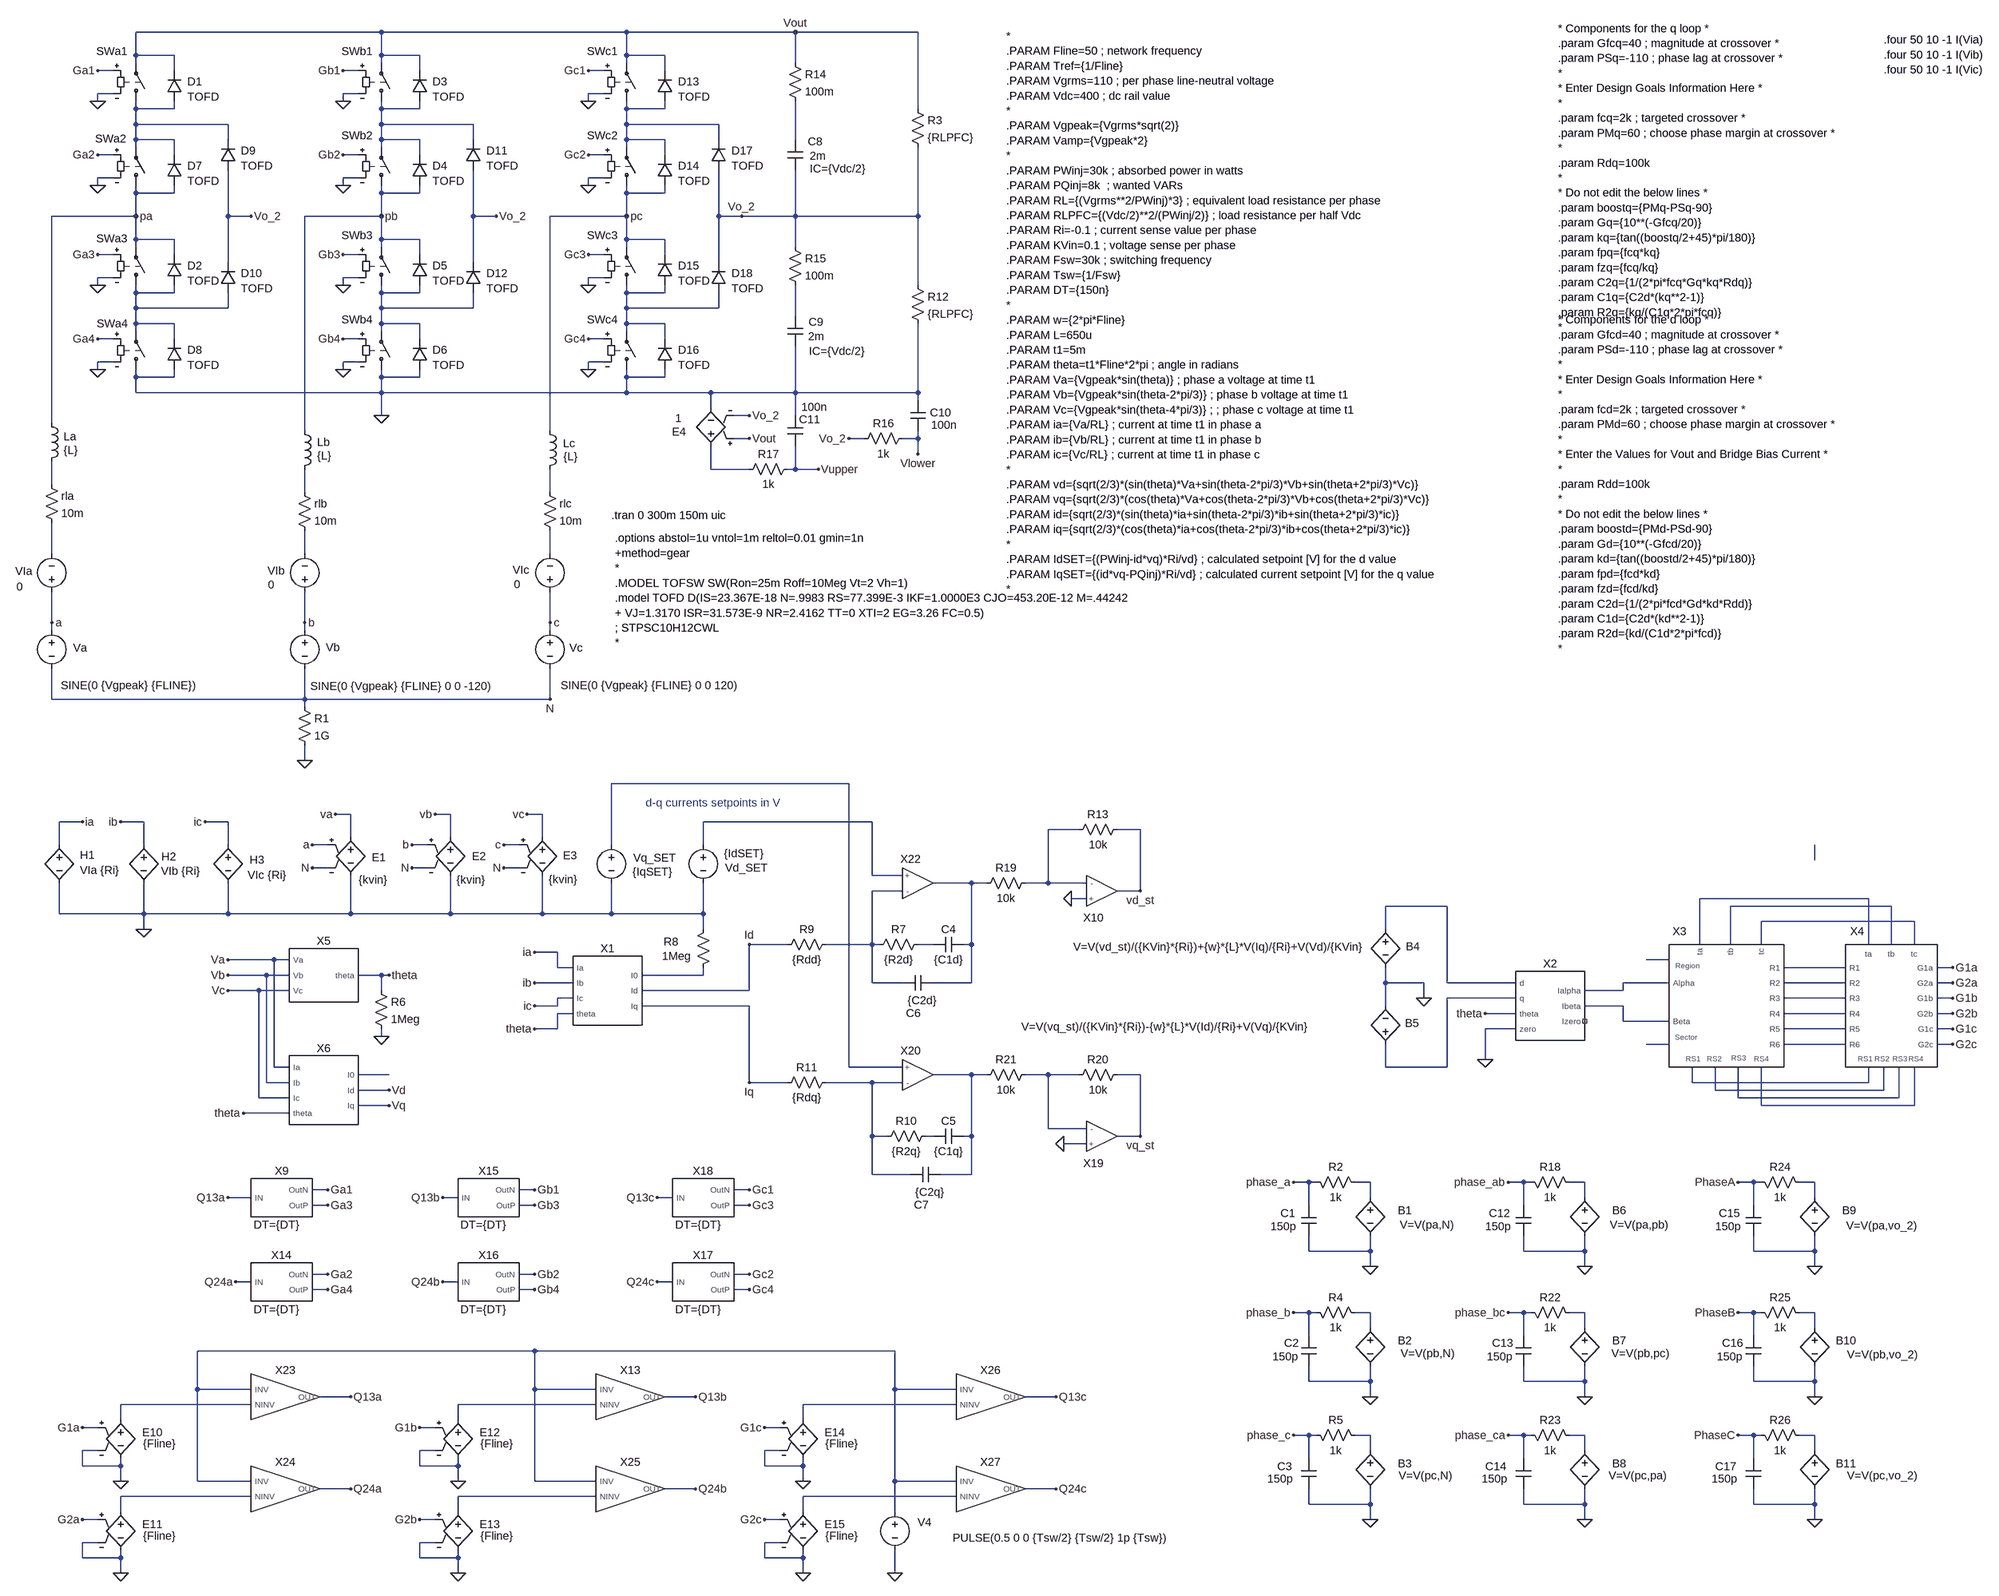
[diagram p0: schematic 3-phase NPC inverter with switches - PFC open loop - SVM.asc]
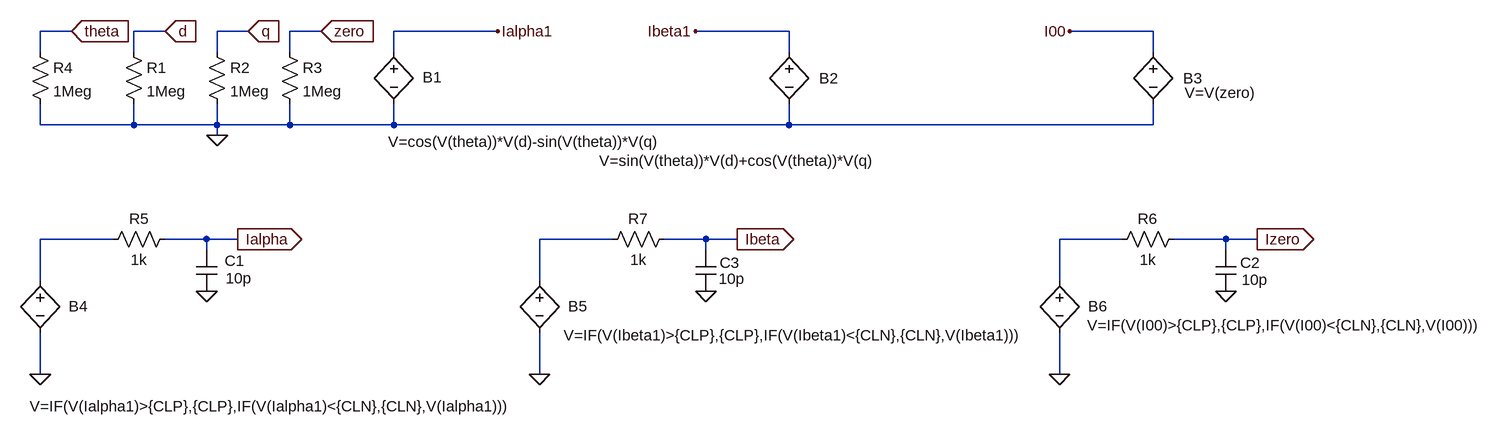
[diagram p1: sub-circuit inverse_dq_alpha_beta.asc]
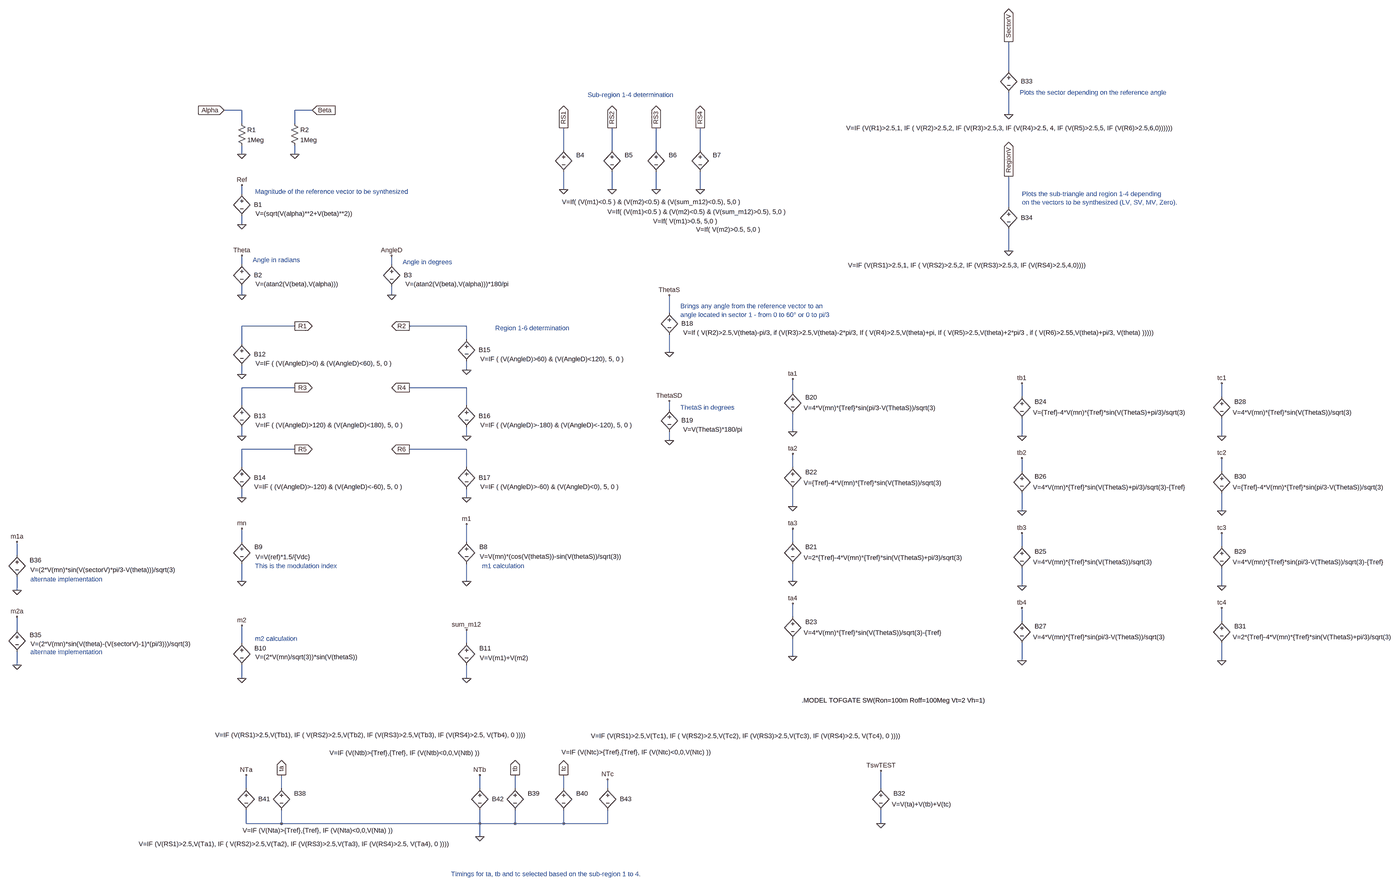
[diagram p2: sub-circuit alphabetatimings.asc, whole sheet]
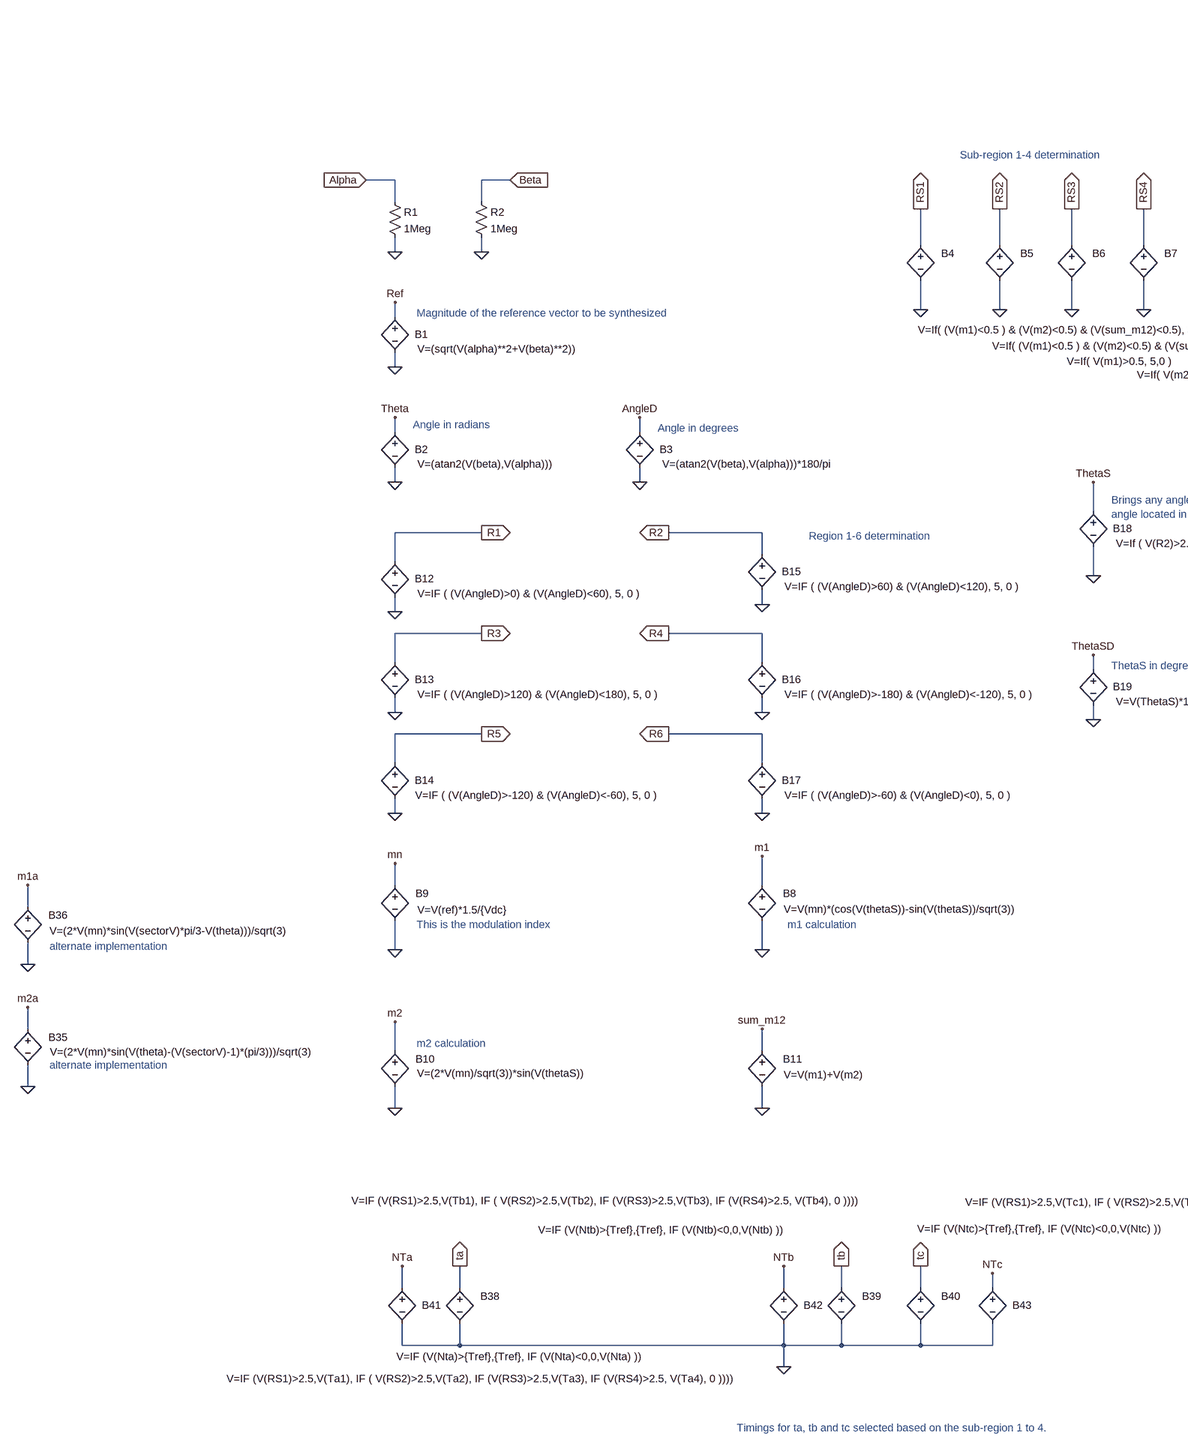
[diagram p3: sub-circuit alphabetatimings.asc, part, row 1 of 1, column 1 of 2]
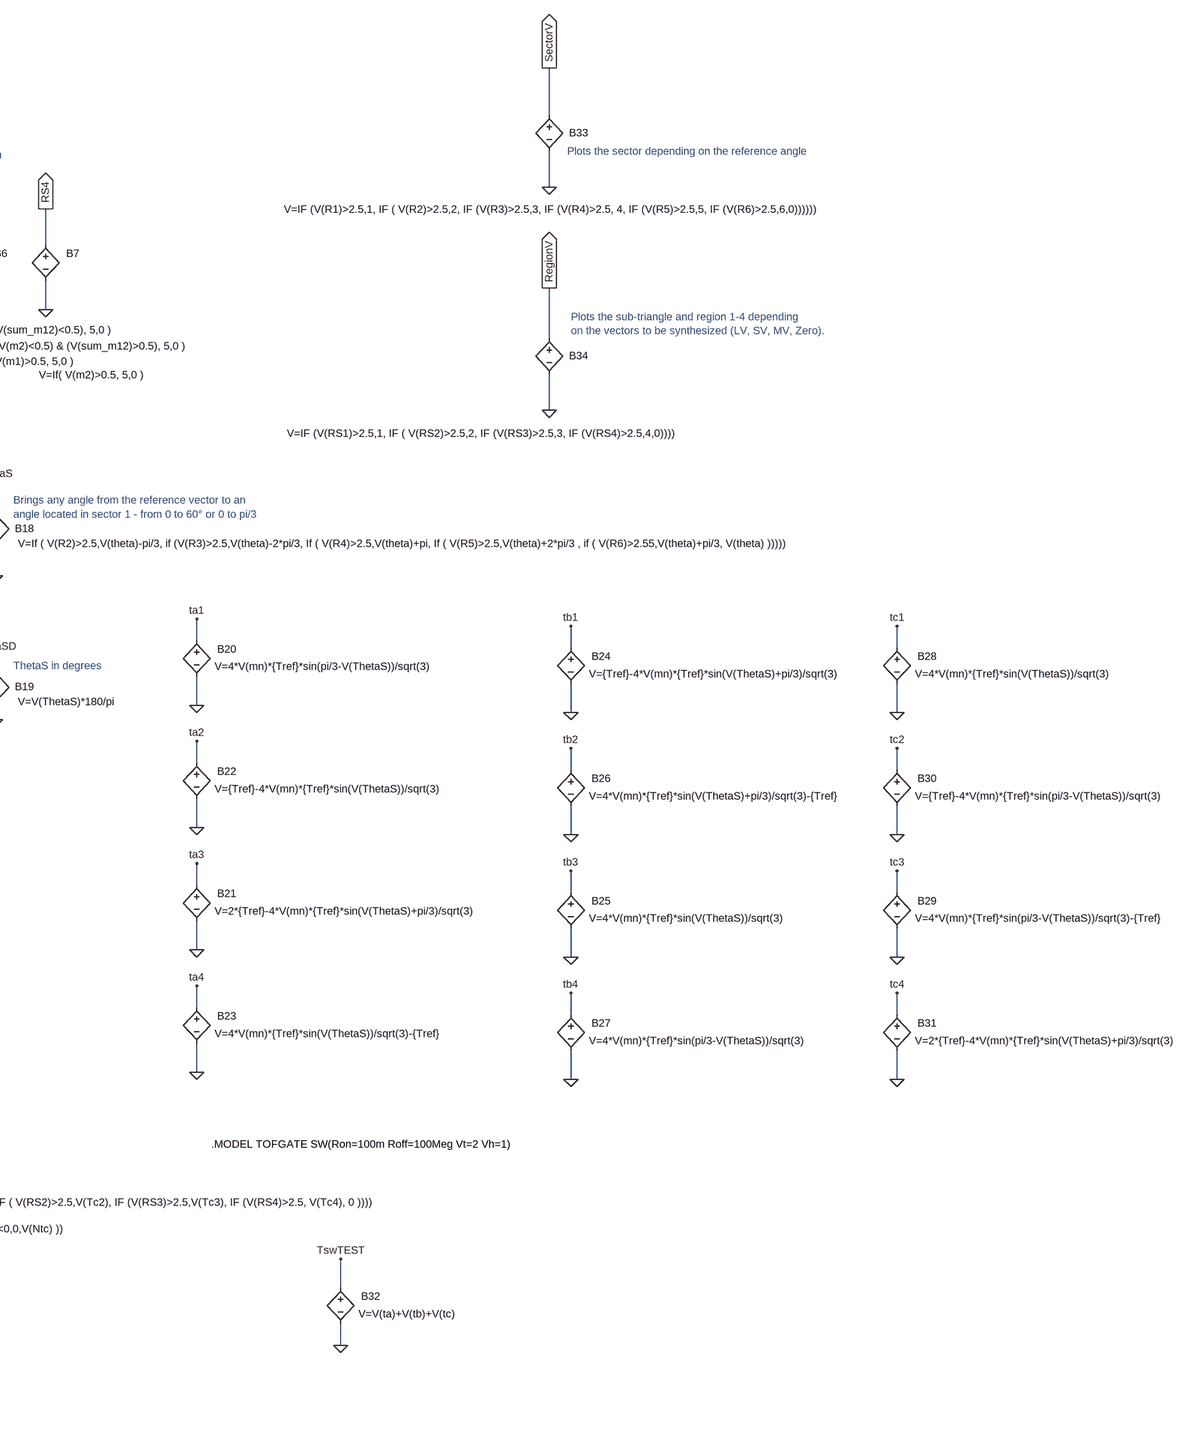
[diagram p4: sub-circuit alphabetatimings.asc, part, row 1 of 1, column 2 of 2]
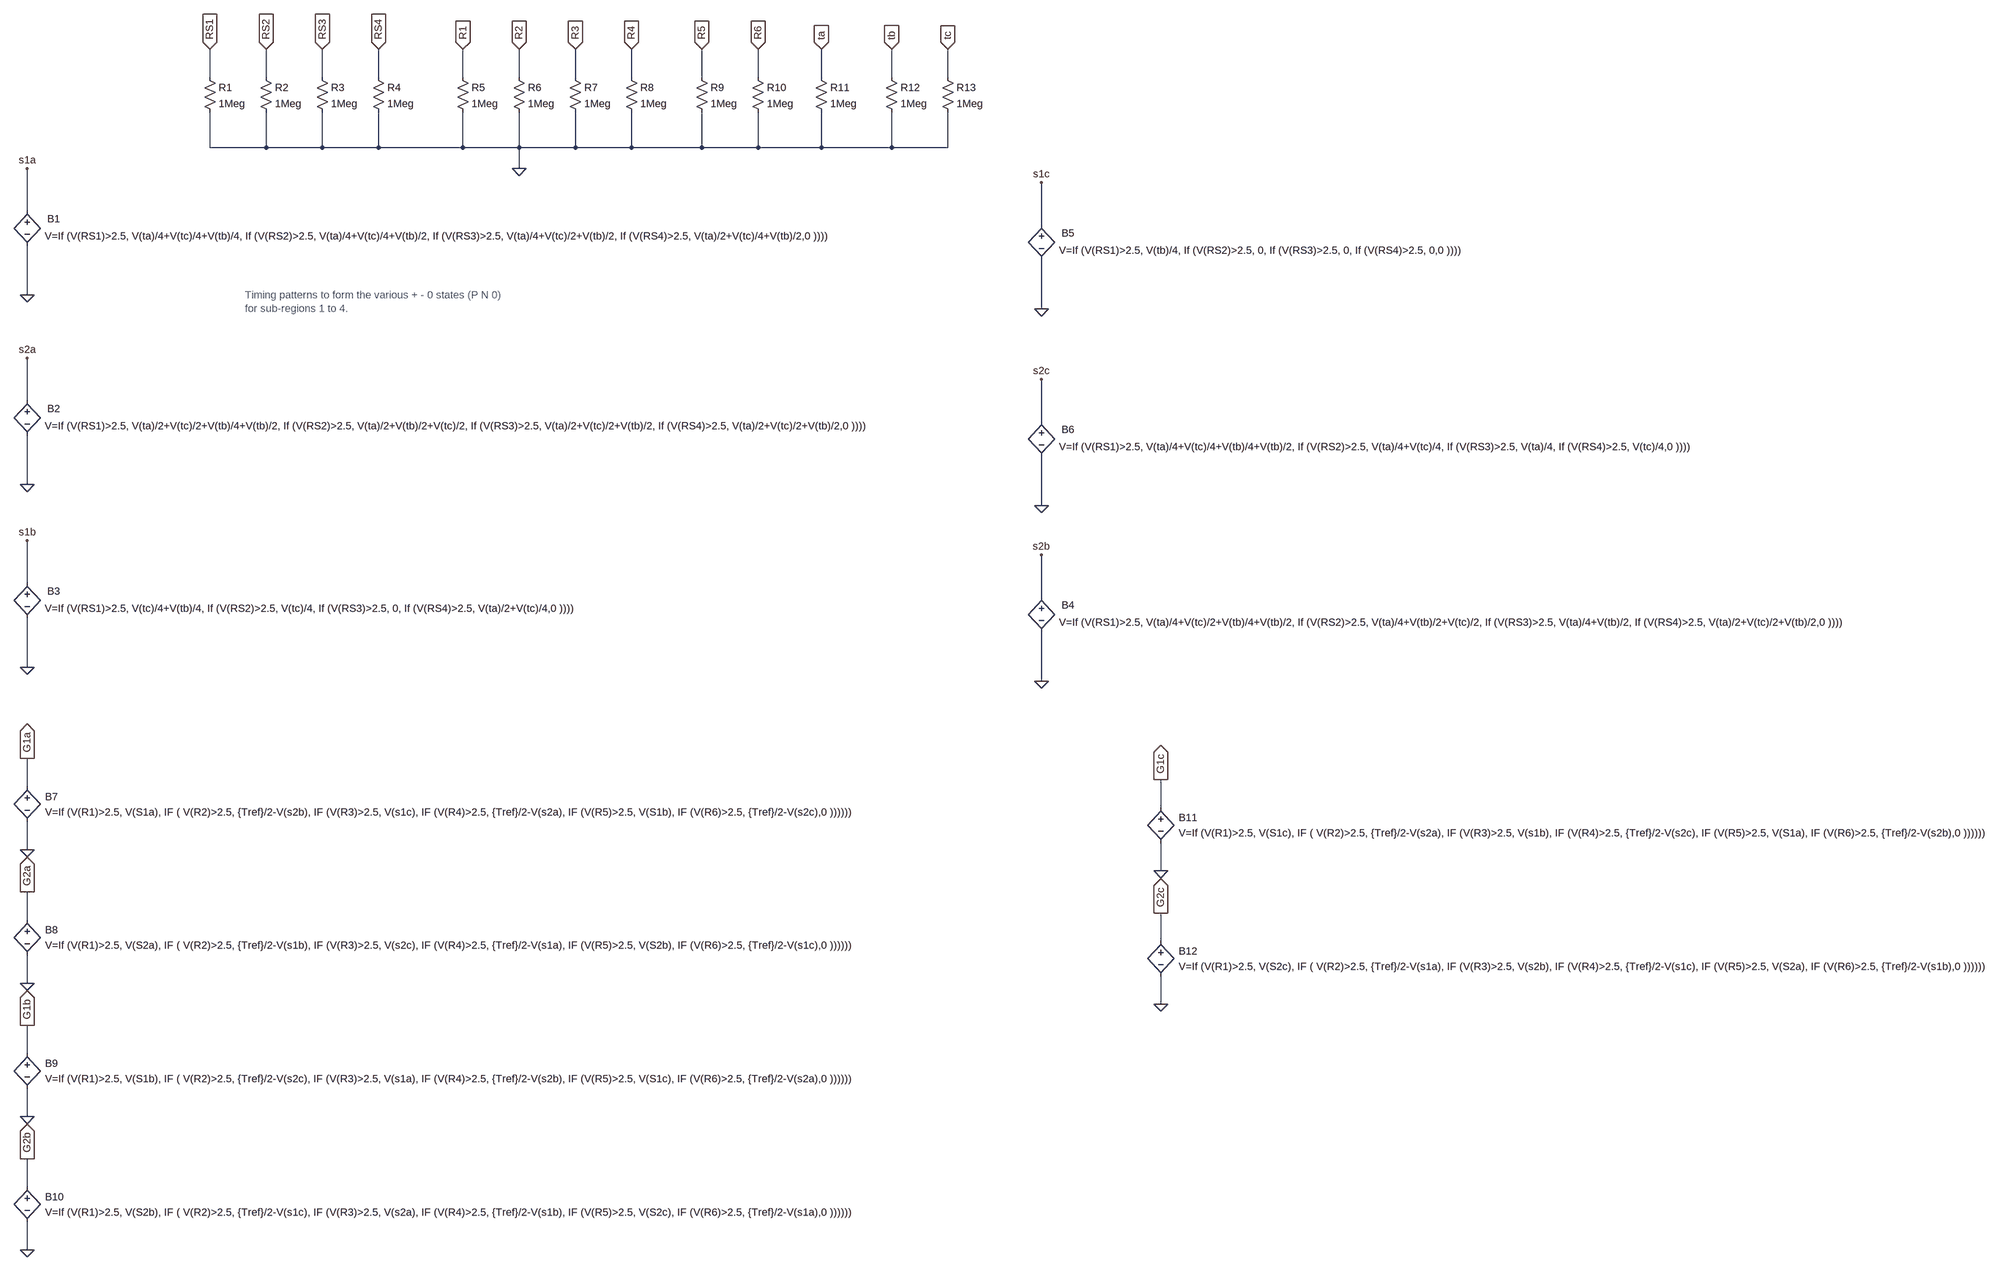
[diagram p5: sub-circuit timinggenerator.asc]
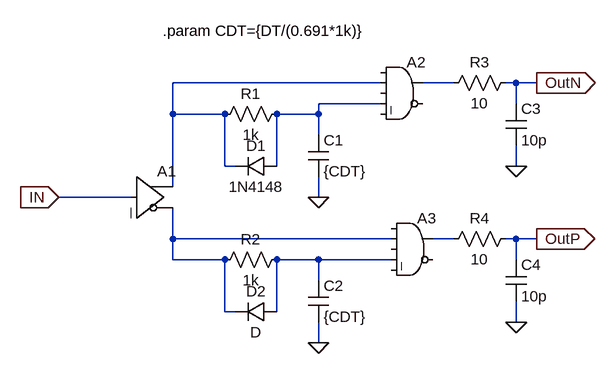
[diagram p6: sub-circuit dt_driver.asc]
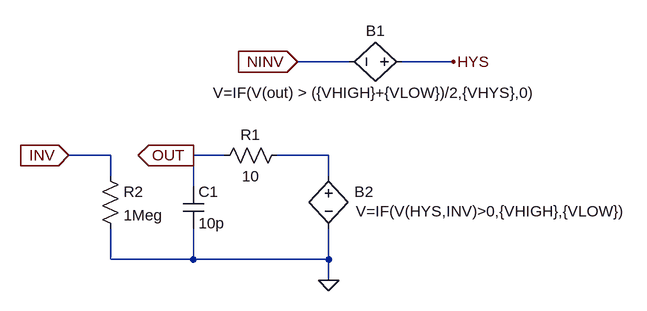
[diagram p7: sub-circuit comptof.asc]
3-phase NPC inverter with switches - PFC open loop - SVM.asc, the LTspice schematic file:
Version 4.1
SHEET 1 4820 2676
WIRE 496 -1056 -16 -1056
WIRE 1008 -1056 496 -1056
WIRE 1360 -1056 1008 -1056
WIRE 1616 -1056 1360 -1056
WIRE -16 -1008 -16 -1056
WIRE 64 -1008 -16 -1008
WIRE 496 -1008 496 -1056
WIRE 576 -1008 496 -1008
WIRE 1008 -1008 1008 -1056
WIRE 1088 -1008 1008 -1008
WIRE -16 -992 -16 -1008
WIRE 496 -992 496 -1008
WIRE 1008 -992 1008 -1008
WIRE 1360 -992 1360 -1056
WIRE -64 -976 -96 -976
WIRE 64 -976 64 -1008
WIRE 448 -976 416 -976
WIRE 576 -976 576 -1008
WIRE 960 -976 928 -976
WIRE 1088 -976 1088 -1008
WIRE -64 -928 -96 -928
WIRE 448 -928 416 -928
WIRE 960 -928 928 -928
WIRE -96 -912 -96 -928
WIRE 416 -912 416 -928
WIRE 928 -912 928 -928
WIRE -16 -896 -16 -912
WIRE 64 -896 64 -912
WIRE 64 -896 -16 -896
WIRE 496 -896 496 -912
WIRE 576 -896 576 -912
WIRE 576 -896 496 -896
WIRE 1008 -896 1008 -912
WIRE 1088 -896 1088 -912
WIRE 1088 -896 1008 -896
WIRE 1616 -896 1616 -1056
WIRE -16 -864 -16 -896
WIRE 176 -864 -16 -864
WIRE 496 -864 496 -896
WIRE 688 -864 496 -864
WIRE 1008 -864 1008 -896
WIRE 1200 -864 1008 -864
WIRE -16 -832 -16 -864
WIRE 64 -832 -16 -832
WIRE 176 -832 176 -864
WIRE 496 -832 496 -864
WIRE 576 -832 496 -832
WIRE 688 -832 688 -864
WIRE 1008 -832 1008 -864
WIRE 1088 -832 1008 -832
WIRE 1200 -832 1200 -864
WIRE 1360 -832 1360 -912
WIRE -16 -816 -16 -832
WIRE 496 -816 496 -832
WIRE 1008 -816 1008 -832
WIRE -64 -800 -96 -800
WIRE 64 -800 64 -832
WIRE 448 -800 416 -800
WIRE 576 -800 576 -832
WIRE 960 -800 928 -800
WIRE 1088 -800 1088 -832
WIRE -64 -752 -96 -752
WIRE 448 -752 416 -752
WIRE 960 -752 928 -752
WIRE -96 -736 -96 -752
WIRE 416 -736 416 -752
WIRE 928 -736 928 -752
WIRE -16 -720 -16 -736
WIRE 64 -720 64 -736
WIRE 64 -720 -16 -720
WIRE 496 -720 496 -736
WIRE 576 -720 576 -736
WIRE 576 -720 496 -720
WIRE 1008 -720 1008 -736
WIRE 1088 -720 1088 -736
WIRE 1088 -720 1008 -720
WIRE -16 -672 -16 -720
WIRE -16 -672 -192 -672
WIRE 176 -672 176 -768
WIRE 224 -672 176 -672
WIRE 496 -672 496 -720
WIRE 496 -672 336 -672
WIRE 688 -672 688 -768
WIRE 736 -672 688 -672
WIRE 1008 -672 1008 -720
WIRE 1008 -672 848 -672
WIRE 1200 -672 1200 -768
WIRE 1248 -672 1200 -672
WIRE 1360 -672 1360 -768
WIRE 1360 -672 1248 -672
WIRE 1616 -672 1616 -816
WIRE 1616 -672 1360 -672
WIRE -16 -624 -16 -672
WIRE 64 -624 -16 -624
WIRE 496 -624 496 -672
WIRE 576 -624 496 -624
WIRE 1008 -624 1008 -672
WIRE 1088 -624 1008 -624
WIRE -16 -608 -16 -624
WIRE 496 -608 496 -624
WIRE 1008 -608 1008 -624
WIRE 1360 -608 1360 -672
WIRE -64 -592 -96 -592
WIRE 64 -592 64 -624
WIRE 448 -592 416 -592
WIRE 576 -592 576 -624
WIRE 960 -592 928 -592
WIRE 1088 -592 1088 -624
WIRE 176 -576 176 -672
WIRE 688 -576 688 -672
WIRE 1200 -576 1200 -672
WIRE -64 -544 -96 -544
WIRE 448 -544 416 -544
WIRE 960 -544 928 -544
WIRE -96 -528 -96 -544
WIRE 416 -528 416 -544
WIRE 928 -528 928 -544
WIRE 1616 -528 1616 -672
WIRE -16 -512 -16 -528
WIRE 64 -512 64 -528
WIRE 64 -512 -16 -512
WIRE 496 -512 496 -528
WIRE 576 -512 576 -528
WIRE 576 -512 496 -512
WIRE 1008 -512 1008 -528
WIRE 1088 -512 1088 -528
WIRE 1088 -512 1008 -512
WIRE -16 -480 -16 -512
WIRE 176 -480 176 -512
WIRE 176 -480 -16 -480
WIRE 496 -480 496 -512
WIRE 688 -480 688 -512
WIRE 688 -480 496 -480
WIRE 1008 -480 1008 -512
WIRE 1200 -480 1200 -512
WIRE 1200 -480 1008 -480
WIRE 1360 -464 1360 -528
WIRE -16 -448 -16 -480
WIRE 64 -448 -16 -448
WIRE 496 -448 496 -480
WIRE 576 -448 496 -448
WIRE 1008 -448 1008 -480
WIRE 1088 -448 1008 -448
WIRE -16 -432 -16 -448
WIRE 496 -432 496 -448
WIRE 1008 -432 1008 -448
WIRE -64 -416 -96 -416
WIRE 64 -416 64 -448
WIRE 448 -416 416 -416
WIRE 576 -416 576 -448
WIRE 960 -416 928 -416
WIRE 1088 -416 1088 -448
WIRE -64 -368 -96 -368
WIRE 448 -368 416 -368
WIRE 960 -368 928 -368
WIRE -96 -352 -96 -368
WIRE 416 -352 416 -368
WIRE 928 -352 928 -368
WIRE -16 -336 -16 -352
WIRE 64 -336 64 -352
WIRE 64 -336 -16 -336
WIRE 496 -336 496 -352
WIRE 576 -336 576 -352
WIRE 576 -336 496 -336
WIRE 1008 -336 1008 -352
WIRE 1088 -336 1088 -352
WIRE 1088 -336 1008 -336
WIRE -16 -304 -16 -336
WIRE 496 -304 496 -336
WIRE 496 -304 -16 -304
WIRE 1008 -304 1008 -336
WIRE 1008 -304 496 -304
WIRE 1184 -304 1008 -304
WIRE 1360 -304 1360 -400
WIRE 1360 -304 1184 -304
WIRE 1616 -304 1616 -448
WIRE 1616 -304 1360 -304
WIRE 1616 -288 1616 -304
WIRE 1184 -272 1184 -304
WIRE 496 -256 496 -304
WIRE 1264 -256 1232 -256
WIRE 1360 -256 1360 -304
WIRE -192 -240 -192 -672
WIRE 336 -224 336 -672
WIRE 848 -224 848 -672
WIRE 1264 -208 1232 -208
WIRE 1504 -208 1472 -208
WIRE 1616 -208 1616 -224
WIRE 1616 -208 1584 -208
WIRE 1616 -176 1616 -208
WIRE 1184 -144 1184 -192
WIRE 1264 -144 1184 -144
WIRE 1360 -144 1360 -192
WIRE 1360 -144 1344 -144
WIRE 1408 -144 1360 -144
WIRE -192 -112 -192 -160
WIRE 336 -96 336 -144
WIRE 848 -96 848 -144
WIRE -192 32 -192 -32
WIRE 336 32 336 -16
WIRE 848 32 848 -16
WIRE -192 176 -192 112
WIRE 336 176 336 112
WIRE 848 176 848 112
WIRE -192 192 -192 176
WIRE 336 192 336 176
WIRE 848 192 848 176
WIRE -192 336 -192 272
WIRE 336 336 336 272
WIRE 336 336 -192 336
WIRE 848 336 848 272
WIRE 848 336 336 336
WIRE 336 352 336 336
WIRE 336 464 336 432
WIRE 1472 512 976 512
WIRE 432 576 400 576
WIRE 640 576 608 576
WIRE 832 576 800 576
WIRE -128 592 -176 592
WIRE 0 592 -48 592
WIRE 176 592 128 592
WIRE 1520 592 1168 592
WIRE 1952 608 1888 608
WIRE 2080 608 2032 608
WIRE 432 624 432 576
WIRE 640 624 640 576
WIRE 832 624 832 576
WIRE -176 640 -176 592
WIRE 0 640 0 592
WIRE 176 640 176 592
WIRE 384 640 352 640
WIRE 592 640 560 640
WIRE 784 640 752 640
WIRE 976 640 976 512
WIRE 1168 640 1168 592
WIRE 3488 672 3488 640
WIRE 384 688 352 688
WIRE 592 688 560 688
WIRE 784 688 752 688
WIRE 1520 704 1520 592
WIRE 1584 704 1520 704
WIRE 1728 720 1648 720
WIRE 1760 720 1728 720
WIRE 1888 720 1888 608
WIRE 1888 720 1840 720
WIRE 1968 720 1888 720
WIRE 1584 736 1520 736
WIRE 2080 736 2080 608
WIRE 2080 736 2032 736
WIRE 1968 752 1936 752
WIRE 3600 752 3248 752
WIRE 2720 768 2592 768
WIRE 3648 768 3312 768
WIRE -176 784 -176 720
WIRE 0 784 0 720
WIRE 0 784 -176 784
WIRE 176 784 176 720
WIRE 176 784 0 784
WIRE 432 784 432 704
WIRE 432 784 176 784
WIRE 640 784 640 704
WIRE 640 784 432 784
WIRE 832 784 832 704
WIRE 832 784 640 784
WIRE 976 784 976 720
WIRE 976 784 832 784
WIRE 1168 784 1168 720
WIRE 1168 784 976 784
WIRE 3696 800 3376 800
WIRE 0 816 0 784
WIRE 1168 816 1168 784
WIRE 2592 816 2592 768
WIRE 1344 848 1264 848
WIRE 1520 848 1520 736
WIRE 1520 848 1424 848
WIRE 1536 848 1520 848
WIRE 1648 848 1616 848
WIRE 1728 848 1728 720
WIRE 1728 848 1712 848
WIRE 3248 848 3248 752
WIRE 3312 848 3312 768
WIRE 3376 848 3376 800
WIRE 3600 848 3600 752
WIRE 3648 848 3648 768
WIRE 3696 848 3696 800
WIRE 864 864 816 864
WIRE 272 880 176 880
WIRE 304 880 272 880
WIRE 3184 880 3136 880
WIRE 864 896 864 864
WIRE 896 896 864 896
WIRE 3552 896 3424 896
WIRE 3776 896 3744 896
WIRE 256 912 176 912
WIRE 304 912 256 912
WIRE 496 912 448 912
WIRE 512 912 496 912
WIRE 1168 912 1168 896
WIRE 1168 912 1040 912
WIRE 896 928 816 928
WIRE 1520 928 1520 848
WIRE 1584 928 1520 928
WIRE 1728 928 1728 848
WIRE 1728 928 1648 928
WIRE 2592 928 2592 896
WIRE 2672 928 2592 928
WIRE 2720 928 2720 768
WIRE 2864 928 2720 928
WIRE 3184 928 3088 928
WIRE 3552 928 3424 928
WIRE 3776 928 3744 928
WIRE 240 944 176 944
WIRE 304 944 240 944
WIRE 496 944 496 912
WIRE 1264 944 1264 848
WIRE 1264 944 1040 944
WIRE 3088 944 3088 928
WIRE 3088 944 3008 944
WIRE 896 960 864 960
WIRE 2672 960 2672 928
WIRE 2864 960 2720 960
WIRE 3552 960 3424 960
WIRE 3776 960 3744 960
WIRE 864 976 864 960
WIRE 864 976 816 976
WIRE 1264 976 1040 976
WIRE 2592 976 2592 928
WIRE 3088 976 3008 976
WIRE 896 992 864 992
WIRE 2864 992 2800 992
WIRE 3552 992 3424 992
WIRE 3776 992 3744 992
WIRE 3088 1008 3088 976
WIRE 3184 1008 3088 1008
WIRE 864 1024 864 992
WIRE 864 1024 816 1024
WIRE 2864 1024 2800 1024
WIRE 3552 1024 3424 1024
WIRE 3776 1024 3744 1024
WIRE 496 1040 496 1024
WIRE 3184 1056 3136 1056
WIRE 3552 1056 3424 1056
WIRE 3776 1056 3744 1056
WIRE 2800 1088 2800 1024
WIRE 272 1104 272 880
WIRE 304 1104 272 1104
WIRE 1472 1104 1472 512
WIRE 1584 1104 1472 1104
WIRE 2592 1104 2592 1056
WIRE 2720 1104 2720 960
WIRE 2720 1104 2592 1104
WIRE 512 1120 448 1120
WIRE 1728 1120 1648 1120
WIRE 1760 1120 1728 1120
WIRE 1888 1120 1840 1120
WIRE 1952 1120 1888 1120
WIRE 2080 1120 2032 1120
WIRE 256 1136 256 912
WIRE 304 1136 256 1136
WIRE 1264 1136 1264 976
WIRE 1344 1136 1264 1136
WIRE 1520 1136 1424 1136
WIRE 1584 1136 1520 1136
WIRE 3232 1136 3232 1104
WIRE 3600 1136 3600 1104
WIRE 3600 1136 3232 1136
WIRE 512 1152 448 1152
WIRE 3280 1152 3280 1104
WIRE 3632 1152 3632 1104
WIRE 3632 1152 3280 1152
WIRE 240 1168 240 944
WIRE 304 1168 240 1168
WIRE 3328 1168 3328 1104
WIRE 3664 1168 3664 1104
WIRE 3664 1168 3328 1168
WIRE 512 1184 448 1184
WIRE 3376 1184 3376 1104
WIRE 3696 1184 3696 1104
WIRE 3696 1184 3376 1184
WIRE 304 1200 208 1200
WIRE 1888 1232 1888 1120
WIRE 1968 1232 1888 1232
WIRE 1520 1248 1520 1136
WIRE 1552 1248 1520 1248
WIRE 1648 1248 1632 1248
WIRE 1728 1248 1728 1120
WIRE 1728 1248 1712 1248
WIRE 2080 1248 2080 1120
WIRE 2080 1248 2032 1248
WIRE 1968 1264 1920 1264
WIRE 1520 1328 1520 1248
WIRE 1600 1328 1520 1328
WIRE 1728 1328 1728 1248
WIRE 1728 1328 1664 1328
WIRE 2432 1344 2400 1344
WIRE 2448 1344 2432 1344
WIRE 2560 1344 2528 1344
WIRE 2880 1344 2848 1344
WIRE 2896 1344 2880 1344
WIRE 3008 1344 2976 1344
WIRE 3360 1344 3328 1344
WIRE 3376 1344 3360 1344
WIRE 3488 1344 3456 1344
WIRE 384 1360 352 1360
WIRE 816 1360 784 1360
WIRE 1264 1360 1232 1360
WIRE 224 1376 176 1376
WIRE 656 1376 624 1376
WIRE 1104 1376 1072 1376
WIRE 2560 1376 2560 1344
WIRE 3008 1376 3008 1344
WIRE 3488 1376 3488 1344
WIRE 384 1392 352 1392
WIRE 816 1392 784 1392
WIRE 1264 1392 1232 1392
WIRE 2432 1392 2432 1344
WIRE 2880 1392 2880 1344
WIRE 3360 1392 3360 1344
WIRE 2432 1488 2432 1456
WIRE 2560 1488 2560 1456
WIRE 2560 1488 2432 1488
WIRE 2880 1488 2880 1456
WIRE 3008 1488 3008 1456
WIRE 3008 1488 2880 1488
WIRE 3360 1488 3360 1456
WIRE 3488 1488 3488 1456
WIRE 3488 1488 3360 1488
WIRE 2560 1520 2560 1488
WIRE 3008 1520 3008 1488
WIRE 3488 1520 3488 1488
WIRE 384 1536 352 1536
WIRE 816 1536 784 1536
WIRE 1264 1536 1232 1536
WIRE 224 1552 192 1552
WIRE 656 1552 624 1552
WIRE 1104 1552 1072 1552
WIRE 384 1568 352 1568
WIRE 816 1568 784 1568
WIRE 1264 1568 1232 1568
WIRE 2432 1616 2400 1616
WIRE 2448 1616 2432 1616
WIRE 2560 1616 2528 1616
WIRE 2880 1616 2848 1616
WIRE 2896 1616 2880 1616
WIRE 3008 1616 2976 1616
WIRE 3360 1616 3328 1616
WIRE 3376 1616 3360 1616
WIRE 3488 1616 3456 1616
WIRE 2560 1648 2560 1616
WIRE 3008 1648 3008 1616
WIRE 3488 1648 3488 1616
WIRE 2432 1664 2432 1616
WIRE 2880 1664 2880 1616
WIRE 3360 1664 3360 1616
WIRE 816 1696 112 1696
WIRE 1568 1696 816 1696
WIRE 2432 1760 2432 1728
WIRE 2560 1760 2560 1728
WIRE 2560 1760 2432 1760
WIRE 2880 1760 2880 1728
WIRE 3008 1760 3008 1728
WIRE 3008 1760 2880 1760
WIRE 3360 1760 3360 1728
WIRE 3488 1760 3488 1728
WIRE 3488 1760 3360 1760
WIRE 112 1776 112 1696
WIRE 224 1776 112 1776
WIRE 816 1776 816 1696
WIRE 944 1776 816 1776
WIRE 1568 1776 1568 1696
WIRE 1696 1776 1568 1776
WIRE 432 1792 368 1792
WIRE 1152 1792 1088 1792
WIRE 1904 1792 1840 1792
WIRE 2560 1792 2560 1760
WIRE 3008 1792 3008 1760
WIRE 3488 1792 3488 1760
WIRE 224 1808 -48 1808
WIRE 944 1808 656 1808
WIRE 1696 1808 1376 1808
WIRE -48 1840 -48 1808
WIRE 656 1840 656 1808
WIRE 1376 1840 1376 1808
WIRE -96 1856 -128 1856
WIRE 608 1856 576 1856
WIRE 1328 1856 1296 1856
WIRE 2432 1872 2400 1872
WIRE 2448 1872 2432 1872
WIRE 2560 1872 2528 1872
WIRE 2880 1872 2848 1872
WIRE 2896 1872 2880 1872
WIRE 3008 1872 2976 1872
WIRE 3360 1872 3328 1872
WIRE 3376 1872 3360 1872
WIRE 3488 1872 3456 1872
WIRE -96 1904 -128 1904
WIRE 608 1904 576 1904
WIRE 1328 1904 1296 1904
WIRE 2560 1904 2560 1872
WIRE 3008 1904 3008 1872
WIRE 3488 1904 3488 1872
WIRE 2432 1920 2432 1872
WIRE 2880 1920 2880 1872
WIRE 3360 1920 3360 1872
WIRE -128 1936 -128 1904
WIRE -48 1936 -48 1920
WIRE -48 1936 -128 1936
WIRE 576 1936 576 1904
WIRE 656 1936 656 1920
WIRE 656 1936 576 1936
WIRE 1296 1936 1296 1904
WIRE 1376 1936 1376 1920
WIRE 1376 1936 1296 1936
WIRE -48 1968 -48 1936
WIRE 112 1968 112 1776
WIRE 224 1968 112 1968
WIRE 656 1968 656 1936
WIRE 816 1968 816 1776
WIRE 944 1968 816 1968
WIRE 1376 1968 1376 1936
WIRE 1568 1968 1568 1776
WIRE 1696 1968 1568 1968
WIRE 432 1984 368 1984
WIRE 1152 1984 1088 1984
WIRE 1904 1984 1840 1984
WIRE 224 2000 -48 2000
WIRE 944 2000 656 2000
WIRE 1696 2000 1376 2000
WIRE 2432 2016 2432 1984
WIRE 2560 2016 2560 1984
WIRE 2560 2016 2432 2016
WIRE 2880 2016 2880 1984
WIRE 3008 2016 3008 1984
WIRE 3008 2016 2880 2016
WIRE 3360 2016 3360 1984
WIRE 3488 2016 3488 1984
WIRE 3488 2016 3360 2016
WIRE -48 2032 -48 2000
WIRE 656 2032 656 2000
WIRE 1376 2032 1376 2000
WIRE 1568 2032 1568 1968
WIRE -96 2048 -128 2048
WIRE 608 2048 576 2048
WIRE 1328 2048 1296 2048
WIRE 2560 2048 2560 2016
WIRE 3008 2048 3008 2016
WIRE 3488 2048 3488 2016
WIRE -96 2096 -128 2096
WIRE 608 2096 576 2096
WIRE 1328 2096 1296 2096
WIRE -128 2128 -128 2096
WIRE -48 2128 -48 2112
WIRE -48 2128 -128 2128
WIRE 576 2128 576 2096
WIRE 656 2128 656 2112
WIRE 656 2128 576 2128
WIRE 1296 2128 1296 2096
WIRE 1376 2128 1376 2112
WIRE 1376 2128 1296 2128
WIRE -48 2160 -48 2128
WIRE 656 2160 656 2128
WIRE 1376 2160 1376 2128
WIRE 1568 2160 1568 2112
FLAG -128 592 ia
FLAG -48 592 ib
FLAG 128 592 ic
FLAG -192 176 a
FLAG 336 176 b
FLAG 848 176 c
FLAG 0 816 0
FLAG 400 576 va
FLAG 848 336 N
FLAG 352 688 N
FLAG 352 640 a
FLAG 608 576 vb
FLAG 560 688 N
FLAG 560 640 b
FLAG 800 576 vc
FLAG 752 688 N
FLAG 752 640 c
FLAG 816 864 ia
FLAG 816 928 ib
FLAG 816 976 ic
FLAG 816 1024 theta
FLAG 2800 992 theta
FLAG -96 -352 0
FLAG -96 -528 0
FLAG -96 -736 0
FLAG -96 -912 0
FLAG 1248 -672 Vo_2
FLAG 224 -672 Vo_2
FLAG 416 -352 0
FLAG 416 -528 0
FLAG 416 -736 0
FLAG 416 -912 0
FLAG 736 -672 Vo_2
FLAG 928 -352 0
FLAG 928 -528 0
FLAG 928 -736 0
FLAG 928 -912 0
FLAG -96 -976 Ga1
FLAG -96 -800 Ga2
FLAG -96 -592 Ga3
FLAG -96 -416 Ga4
FLAG 416 -976 Gb1
FLAG 416 -800 Gb2
FLAG 416 -592 Gb3
FLAG 416 -416 Gb4
FLAG 928 -976 Gc1
FLAG 928 -800 Gc2
FLAG 928 -592 Gc3
FLAG 928 -416 Gc4
FLAG 384 1392 Ga3
FLAG 384 1360 Ga1
FLAG 384 1568 Ga4
FLAG 384 1536 Ga2
FLAG 176 1376 Q13a
FLAG 192 1552 Q24a
FLAG 816 1392 Gb3
FLAG 816 1360 Gb1
FLAG 816 1568 Gb4
FLAG 816 1536 Gb2
FLAG 624 1376 Q13b
FLAG 624 1552 Q24b
FLAG 1264 1392 Gc3
FLAG 1264 1360 Gc1
FLAG 1264 1568 Gc4
FLAG 1264 1536 Gc2
FLAG 1072 1376 Q13c
FLAG 1072 1552 Q24c
FLAG 496 -256 0
FLAG 1936 752 0
FLAG 1920 1264 0
FLAG 336 464 0
FLAG 3776 896 G1a
FLAG 3776 928 G2a
FLAG 3776 960 G1b
FLAG 3776 992 G2b
FLAG 3776 1024 G1c
FLAG 3776 1056 G2c
FLAG -16 -672 pa
FLAG 496 -672 pb
FLAG 1008 -672 pc
FLAG 2800 1088 0
FLAG 1568 2160 0
FLAG 432 1792 Q13a
FLAG 432 1984 Q24a
FLAG 1152 1792 Q13b
FLAG 1152 1984 Q24b
FLAG 1904 1792 Q13c
FLAG 1904 1984 Q24c
FLAG -48 1968 0
FLAG -128 1856 G1a
FLAG -48 2160 0
FLAG -128 2048 G2a
FLAG 656 1968 0
FLAG 576 1856 G1b
FLAG 656 2160 0
FLAG 576 2048 G2b
FLAG 1376 1968 0
FLAG 1296 1856 G1c
FLAG 1376 2160 0
FLAG 1296 2048 G2c
FLAG 2672 960 0
FLAG 2080 736 vd_st
FLAG 2080 1248 vq_st
FLAG 1264 1136 Iq
FLAG 1264 848 Id
FLAG 512 912 theta
FLAG 176 880 Va
FLAG 176 912 Vb
FLAG 176 944 Vc
FLAG 496 1040 0
FLAG 208 1200 theta
FLAG 512 1152 Vd
FLAG 512 1184 Vq
FLAG 1472 -208 Vo_2
FLAG 1616 -176 Vlower
FLAG 1264 -256 Vo_2
FLAG 1264 -208 Vout
FLAG 1408 -144 Vupper
FLAG 1360 -1056 Vout
FLAG 2560 1520 0
FLAG 2400 1344 phase_a
FLAG 2560 1792 0
FLAG 2400 1616 phase_b
FLAG 2560 2048 0
FLAG 2400 1872 phase_c
FLAG 3008 1520 0
FLAG 2848 1344 phase_ab
FLAG 3008 1792 0
FLAG 2848 1616 phase_bc
FLAG 3008 2048 0
FLAG 2848 1872 phase_ca
FLAG 3488 1520 0
FLAG 3328 1344 PhaseA
FLAG 3488 1792 0
FLAG 3328 1616 PhaseB
FLAG 3488 2048 0
FLAG 3328 1872 PhaseC
SYMBOL voltage -192 176 R0
WINDOW 0 45 53 Left 2
WINDOW 3 19 131 Left 2
WINDOW 123 0 0 Left 0
WINDOW 39 0 0 Left 0
SYMATTR InstName Va
SYMATTR Value SINE(0 {Vgpeak} {FLINE})
SYMBOL voltage 336 176 R0
WINDOW 0 44 52 Left 2
WINDOW 3 12 133 Left 2
WINDOW 123 0 0 Left 0
WINDOW 39 0 0 Left 0
SYMATTR InstName Vb
SYMATTR Value SINE(0 {Vgpeak} {FLINE} 0 0 -120)
SYMBOL voltage 848 176 R0
WINDOW 0 41 53 Left 2
WINDOW 3 22 131 Left 2
WINDOW 123 0 0 Left 0
WINDOW 39 0 0 Left 0
SYMATTR InstName Vc
SYMATTR Value SINE(0 {Vgpeak} {FLINE} 0 0 120)
SYMBOL res 320 336 R0
SYMATTR InstName R1
SYMATTR Value 1G
SYMBOL res -208 -128 R0
SYMATTR InstName rla
SYMATTR Value 10m
SYMBOL res 320 -112 R0
SYMATTR InstName rlb
SYMATTR Value 10m
SYMBOL res 832 -112 R0
SYMATTR InstName rlc
SYMATTR Value 10m
SYMBOL h -176 624 R0
WINDOW 0 43 37 Left 2
WINDOW 3 43 69 Left 2
SYMATTR InstName H1
SYMATTR Value VIa {Ri}
SYMBOL h 0 624 R0
WINDOW 0 37 41 Left 2
WINDOW 3 36 71 Left 2
SYMATTR InstName H2
SYMATTR Value VIb {Ri}
SYMBOL h 176 624 R0
WINDOW 0 45 47 Left 2
WINDOW 3 41 79 Left 2
SYMATTR InstName H3
SYMATTR Value VIc {Ri}
SYMBOL ind -208 -256 R0
WINDOW 0 41 44 Left 2
WINDOW 3 41 72 Left 2
SYMATTR InstName La
SYMATTR Value {L}
SYMBOL ind 320 -240 R0
WINDOW 0 42 40 Left 2
WINDOW 3 42 68 Left 2
SYMATTR InstName Lb
SYMATTR Value {L}
SYMBOL ind 832 -240 R0
WINDOW 0 43 42 Left 2
WINDOW 3 44 70 Left 2
SYMATTR InstName Lc
SYMATTR Value {L}
SYMBOL voltage -192 128 R180
WINDOW 0 40 59 Left 2
WINDOW 3 60 27 Left 2
WINDOW 123 0 0 Left 0
WINDOW 39 0 0 Left 0
SYMATTR InstName VIa
SYMATTR Value 0
SYMBOL voltage 336 128 R180
WINDOW 0 41 60 Left 2
WINDOW 3 63 31 Left 2
WINDOW 123 0 0 Left 0
WINDOW 39 0 0 Left 0
SYMATTR InstName VIb
SYMATTR Value 0
SYMBOL voltage 848 128 R180
WINDOW 0 43 62 Left 2
WINDOW 3 62 32 Left 2
WINDOW 123 0 0 Left 0
WINDOW 39 0 0 Left 0
SYMATTR InstName VIc
SYMATTR Value 0
SYMBOL sw -16 -896 M180
WINDOW 3 47 44 Invisible 2
WINDOW 0 -83 120 Left 2
SYMATTR Value TOFSW
SYMATTR InstName SWa1
SYMBOL e 432 608 R0
WINDOW 0 44 58 Left 2
WINDOW 3 17 105 Left 2
SYMATTR InstName E1
SYMATTR Value {kvin}
SYMBOL e 640 608 R0
WINDOW 0 45 56 Left 2
WINDOW 3 13 105 Left 2
SYMATTR InstName E2
SYMATTR Value {kvin}
SYMBOL e 832 608 R0
WINDOW 0 43 54 Left 2
WINDOW 3 13 104 Left 2
SYMATTR InstName E3
SYMATTR Value {kvin}
SYMBOL res 1520 864 R270
WINDOW 0 32 56 VTop 2
WINDOW 3 0 56 VBottom 2
SYMATTR InstName R7
SYMATTR Value {R2d}
SYMBOL cap 1648 864 R270
WINDOW 0 32 32 VTop 2
WINDOW 3 0 32 VBottom 2
SYMATTR InstName C4
SYMATTR Value {C1d}
SYMBOL cap 1584 944 R270
WINDOW 0 -63 23 VTop 2
WINDOW 3 -5 41 VBottom 2
SYMATTR InstName C6
SYMATTR Value {C2d}
SYMBOL res 1184 800 M0
WINDOW 0 68 42 Left 2
WINDOW 3 41 72 Left 2
SYMATTR InstName R8
SYMATTR Value 1Meg
SYMBOL res 1440 832 R90
WINDOW 0 0 56 VBottom 2
WINDOW 3 32 56 VTop 2
SYMATTR InstName R9
SYMATTR Value {Rdd}
SYMBOL res 1536 1264 R270
WINDOW 0 32 56 VTop 2
WINDOW 3 0 56 VBottom 2
SYMATTR InstName R10
SYMATTR Value {R2q}
SYMBOL cap 1648 1264 R270
WINDOW 0 32 32 VTop 2
WINDOW 3 0 32 VBottom 2
SYMATTR InstName C5
SYMATTR Value {C1q}
SYMBOL cap 1600 1344 R270
WINDOW 0 -63 23 VTop 2
WINDOW 3 -5 41 VBottom 2
SYMATTR InstName C7
SYMATTR Value {C2q}
SYMBOL res 1440 1120 R90
WINDOW 0 0 56 VBottom 2
WINDOW 3 32 56 VTop 2
SYMATTR InstName R11
SYMATTR Value {Rdq}
SYMBOL diode 48 -912 M180
WINDOW 0 43 41 Left 2
WINDOW 3 43 9 Left 2
SYMATTR InstName D1
SYMATTR Value TOFD
SYMBOL sw -16 -720 M180
WINDOW 3 47 44 Invisible 2
WINDOW 0 -85 114 Left 2
SYMATTR Value TOFSW
SYMATTR InstName SWa2
SYMBOL diode 48 -736 M180
WINDOW 0 43 41 Left 2
WINDOW 3 43 9 Left 2
SYMATTR InstName D7
SYMATTR Value TOFD
SYMBOL sw -16 -512 M180
WINDOW 3 47 44 Invisible 2
WINDOW 0 -83 113 Left 2
SYMATTR Value TOFSW
SYMATTR InstName SWa3
SYMBOL diode 48 -528 M180
WINDOW 0 43 41 Left 2
WINDOW 3 43 9 Left 2
SYMATTR InstName D2
SYMATTR Value TOFD
SYMBOL sw -16 -336 M180
WINDOW 3 47 44 Invisible 2
WINDOW 0 -82 112 Left 2
SYMATTR Value TOFSW
SYMATTR InstName SWa4
SYMBOL diode 48 -352 M180
WINDOW 0 43 41 Left 2
WINDOW 3 43 9 Left 2
SYMATTR InstName D8
SYMATTR Value TOFD
SYMBOL diode 160 -768 M180
WINDOW 0 43 41 Left 2
WINDOW 3 43 9 Left 2
SYMATTR InstName D9
SYMATTR Value TOFD
SYMBOL diode 160 -512 M180
WINDOW 0 43 41 Left 2
WINDOW 3 43 9 Left 2
SYMATTR InstName D10
SYMATTR Value TOFD
SYMBOL diode 560 -912 M180
WINDOW 0 43 41 Left 2
WINDOW 3 43 9 Left 2
SYMATTR InstName D3
SYMATTR Value TOFD
SYMBOL diode 560 -736 M180
WINDOW 0 43 41 Left 2
WINDOW 3 43 9 Left 2
SYMATTR InstName D4
SYMATTR Value TOFD
SYMBOL diode 560 -528 M180
WINDOW 0 43 41 Left 2
WINDOW 3 43 9 Left 2
SYMATTR InstName D5
SYMATTR Value TOFD
SYMBOL diode 560 -352 M180
WINDOW 0 43 41 Left 2
WINDOW 3 43 9 Left 2
SYMATTR InstName D6
SYMATTR Value TOFD
SYMBOL diode 672 -768 M180
WINDOW 0 43 41 Left 2
WINDOW 3 43 9 Left 2
SYMATTR InstName D11
SYMATTR Value TOFD
SYMBOL diode 672 -512 M180
WINDOW 0 43 41 Left 2
WINDOW 3 43 9 Left 2
SYMATTR InstName D12
SYMATTR Value TOFD
SYMBOL diode 1072 -912 M180
WINDOW 0 43 41 Left 2
WINDOW 3 43 9 Left 2
SYMATTR InstName D13
SYMATTR Value TOFD
SYMBOL diode 1072 -736 M180
WINDOW 0 43 41 Left 2
WINDOW 3 43 9 Left 2
SYMATTR InstName D14
SYMATTR Value TOFD
SYMBOL diode 1072 -528 M180
WINDOW 0 43 41 Left 2
WINDOW 3 43 9 Left 2
SYMATTR InstName D15
SYMATTR Value TOFD
SYMBOL diode 1072 -352 M180
WINDOW 0 43 41 Left 2
WINDOW 3 43 9 Left 2
SYMATTR InstName D16
SYMATTR Value TOFD
SYMBOL diode 1184 -768 M180
WINDOW 0 43 41 Left 2
WINDOW 3 43 9 Left 2
SYMATTR InstName D17
SYMATTR Value TOFD
SYMBOL diode 1184 -512 M180
WINDOW 0 43 41 Left 2
WINDOW 3 43 9 Left 2
SYMATTR InstName D18
SYMATTR Value TOFD
SYMBOL sw 496 -896 M180
WINDOW 3 47 44 Invisible 2
WINDOW 0 -83 120 Left 2
SYMATTR Value TOFSW
SYMATTR InstName SWb1
SYMBOL sw 496 -720 M180
WINDOW 3 47 44 Invisible 2
WINDOW 0 -83 120 Left 2
SYMATTR Value TOFSW
SYMATTR InstName SWb2
SYMBOL sw 496 -512 M180
WINDOW 3 47 44 Invisible 2
WINDOW 0 -83 120 Left 2
SYMATTR Value TOFSW
SYMATTR InstName SWb3
SYMBOL sw 496 -336 M180
WINDOW 3 47 44 Invisible 2
WINDOW 0 -83 120 Left 2
SYMATTR Value TOFSW
SYMATTR InstName SWb4
SYMBOL sw 1008 -896 M180
WINDOW 3 47 44 Invisible 2
WINDOW 0 -83 120 Left 2
SYMATTR Value TOFSW
SYMATTR InstName SWc1
SYMBOL sw 1008 -720 M180
WINDOW 3 47 44 Invisible 2
WINDOW 0 -83 120 Left 2
SYMATTR Value TOFSW
SYMATTR InstName SWc2
SYMBOL sw 1008 -512 M180
WINDOW 3 47 44 Invisible 2
WINDOW 0 -83 120 Left 2
SYMATTR Value TOFSW
SYMATTR InstName SWc3
SYMBOL sw 1008 -336 M180
WINDOW 3 47 44 Invisible 2
WINDOW 0 -83 120 Left 2
SYMATTR Value TOFSW
SYMATTR InstName SWc4
SYMBOL res 2048 592 R90
WINDOW 0 0 56 VBottom 2
WINDOW 3 32 56 VTop 2
SYMATTR InstName R13
SYMATTR Value 10k
SYMBOL res 1856 704 R90
WINDOW 0 0 56 VBottom 2
WINDOW 3 32 56 VTop 2
SYMATTR InstName R19
SYMATTR Value 10k
SYMBOL res 2048 1104 R90
WINDOW 0 0 56 VBottom 2
WINDOW 3 32 56 VTop 2
SYMATTR InstName R20
SYMATTR Value 10k
SYMBOL res 1856 1104 R90
WINDOW 0 0 56 VBottom 2
WINDOW 3 32 56 VTop 2
SYMATTR InstName R21
SYMATTR Value 10k
SYMBOL voltage 1168 624 R0
WINDOW 0 46 64 Left 2
WINDOW 3 43 34 Left 2
WINDOW 123 0 0 Left 0
WINDOW 39 0 0 Left 0
SYMATTR InstName Vd_SET
SYMATTR Value {IdSET}
SYMBOL voltage 976 624 R0
WINDOW 0 46 43 Left 2
WINDOW 3 44 72 Left 2
WINDOW 123 0 0 Left 0
WINDOW 39 0 0 Left 0
SYMATTR InstName Vq_SET
SYMATTR Value {IqSET}
SYMBOL TOF\\3Phase\\SVM\\Inverse_dq_alpha_beta 2928 976 R0
SYMATTR InstName X2
SYMATTR SpiceLine CLP=1500 CLN=-1500
SYMBOL TOF\\3Phase\\SVM\\AlphaBetaTimings 3360 1024 R0
WINDOW 0 -154 -188 Bottom 2
SYMATTR InstName X3
SYMATTR SpiceLine Tsw={Tsw} k1=1
SYMBOL TOF\\3Phase\\SVM\\TimingGenerator 3616 976 R0
WINDOW 0 -39 -140 Bottom 2
SYMATTR InstName X4
SYMATTR SpiceLine Tsw={Tsw}
SYMBOL TOF\\3Phase\\SVM\\dq0_sub 960 944 R0
SYMATTR InstName X1
SYMBOL TOF\\3Phase\\SVM\\opampTOF 1648 736 M180
WINDOW 0 -47 82 Bottom 2
SYMATTR InstName X22
SYMATTR SpiceLine VHIGH=5 VLOW=-5
SYMBOL TOF\\3Phase\\SVM\\opampTOF 2032 720 R0
WINDOW 0 -49 88 Bottom 2
SYMATTR InstName X10
SYMATTR SpiceLine VHIGH=5 VLOW=-5
SYMBOL TOF\\3Phase\\SVM\\opampTOF 2032 1232 R0
WINDOW 0 -49 88 Bottom 2
SYMATTR InstName X19
SYMATTR SpiceLine VHIGH=5 VLOW=-5
SYMBOL TOF\\3Phase\\SVM\\opampTOF 1648 1136 M180
WINDOW 0 -47 82 Bottom 2
SYMATTR InstName X20
SYMATTR SpiceLine VHIGH=5 VLOW=-5
SYMBOL TOF\\3Phase\\SVM\\DT_driver 288 1376 R0
WINDOW 39 -11 73 Bottom 2
SYMATTR SpiceLine DT={DT}
SYMATTR InstName X9
SYMBOL TOF\\3Phase\\SVM\\DT_driver 288 1552 R0
WINDOW 39 -11 73 Bottom 2
SYMATTR SpiceLine DT={DT}
SYMATTR InstName X14
SYMBOL TOF\\3Phase\\SVM\\DT_driver 720 1376 R0
WINDOW 39 -11 73 Bottom 2
SYMATTR SpiceLine DT={DT}
SYMATTR InstName X15
SYMBOL TOF\\3Phase\\SVM\\DT_driver 720 1552 R0
WINDOW 39 -11 73 Bottom 2
SYMATTR SpiceLine DT={DT}
SYMATTR InstName X16
SYMBOL TOF\\3Phase\\SVM\\DT_driver 1168 1552 R0
WINDOW 39 -11 73 Bottom 2
SYMATTR SpiceLine DT={DT}
SYMATTR InstName X17
SYMBOL TOF\\3Phase\\SVM\\DT_driver 1168 1376 R0
WINDOW 39 -11 73 Bottom 2
SYMATTR SpiceLine DT={DT}
SYMATTR InstName X18
SYMBOL voltage 1568 2016 M0
WINDOW 123 0 0 Left 0
WINDOW 39 0 0 Left 0
WINDOW 0 -77 38 Left 2
WINDOW 3 -566 70 Left 2
SYMATTR InstName V4
SYMATTR Value PULSE(0.5 0 0 {Tsw/2} {Tsw/2} 1p {Tsw})
SYMBOL e -48 1824 R0
WINDOW 0 45 42 Left 2
WINDOW 3 47 66 Left 2
SYMATTR InstName E10
SYMATTR Value {Fline}
SYMBOL e -48 2016 R0
WINDOW 0 45 42 Left 2
WINDOW 3 47 66 Left 2
SYMATTR InstName E11
SYMATTR Value {Fline}
SYMBOL e 656 1824 R0
WINDOW 0 45 42 Left 2
WINDOW 3 47 66 Left 2
SYMATTR InstName E12
SYMATTR Value {Fline}
SYMBOL e 656 2016 R0
WINDOW 0 45 42 Left 2
WINDOW 3 47 66 Left 2
SYMATTR InstName E13
SYMATTR Value {Fline}
SYMBOL e 1376 1824 R0
WINDOW 0 45 42 Left 2
WINDOW 3 47 66 Left 2
SYMATTR InstName E14
SYMATTR Value {Fline}
SYMBOL e 1376 2016 R0
WINDOW 0 45 42 Left 2
WINDOW 3 47 66 Left 2
SYMATTR InstName E15
SYMATTR Value {Fline}
SYMBOL TOF\\3Phase\\SVM\\COMPTOF 1008 1792 R0
SYMATTR InstName X13
SYMATTR SpiceLine VHIGH=5 VLOW=100m VHYS=10m
SYMBOL TOF\\3Phase\\SVM\\COMPTOF 288 1792 R0
SYMATTR InstName X23
SYMATTR SpiceLine VHIGH=5 VLOW=100m VHYS=10m
SYMBOL TOF\\3Phase\\SVM\\COMPTOF 288 1984 R0
SYMATTR InstName X24
SYMATTR SpiceLine VHIGH=5 VLOW=100m VHYS=10m
SYMBOL TOF\\3Phase\\SVM\\COMPTOF 1008 1984 R0
SYMATTR InstName X25
SYMATTR SpiceLine VHIGH=5 VLOW=100m VHYS=10m
SYMBOL TOF\\3Phase\\SVM\\COMPTOF 1760 1792 R0
SYMATTR InstName X26
SYMATTR SpiceLine VHIGH=5 VLOW=100m VHYS=10m
SYMBOL TOF\\3Phase\\SVM\\COMPTOF 1760 1984 R0
SYMATTR InstName X27
SYMATTR SpiceLine VHIGH=5 VLOW=100m VHYS=10m
SYMBOL bv 2592 800 M0
WINDOW 0 -72 52 Left 2
WINDOW 3 50 53 Left 2
SYMATTR InstName B4
SYMATTR Value V=V(vd_st)/({KVin}*{Ri})+{w}*{L}*V(Iq)/{Ri}+V(Vd)/{KVin}
SYMBOL bv 2592 1072 M180
WINDOW 0 41 60 Left 2
WINDOW 3 -760 52 Left 2
SYMATTR InstName B5
SYMATTR Value V=V(vq_st)/({KVin}*{Ri})-{w}*{L}*V(Id)/{Ri}+V(Vq)/{KVin}
SYMBOL res 480 928 R0
SYMATTR InstName R6
SYMATTR Value 1Meg
SYMBOL TOF\\3Phase\\SVM\\theta_sub 368 912 R0
SYMATTR InstName X5
SYMBOL TOF\\3Phase\\SVM\\dq0_sub 368 1152 R0
SYMATTR InstName X6
SYMBOL cap 1344 -832 R0
WINDOW 0 42 4 Left 2
WINDOW 3 46 34 Left 2
WINDOW 123 46 61 Left 2
SYMATTR InstName C8
SYMATTR Value 2m
SYMATTR Value2 IC={Vdc/2}
SYMBOL cap 1344 -464 R0
WINDOW 0 44 13 Left 2
WINDOW 3 43 43 Left 2
WINDOW 123 45 74 Left 2
SYMATTR InstName C9
SYMATTR Value 2m
SYMATTR Value2 IC={Vdc/2}
SYMBOL res 1600 -912 R0
SYMATTR InstName R3
SYMATTR Value {RLPFC}
SYMBOL res 1600 -544 R0
SYMATTR InstName R12
SYMATTR Value {RLPFC}
SYMBOL res 1344 -1008 R0
SYMATTR InstName R14
SYMATTR Value 100m
SYMBOL res 1344 -624 R0
SYMATTR InstName R15
SYMATTR Value 100m
SYMBOL res 1600 -224 R90
WINDOW 0 0 56 VBottom 2
WINDOW 3 32 56 VTop 2
SYMATTR InstName R16
SYMATTR Value 1k
SYMBOL cap 1600 -288 R0
WINDOW 0 41 26 Left 2
WINDOW 3 44 52 Left 2
SYMATTR InstName C10
SYMATTR Value 100n
SYMBOL res 1360 -160 R90
WINDOW 0 0 56 VBottom 2
WINDOW 3 32 56 VTop 2
SYMATTR InstName R17
SYMATTR Value 1k
SYMBOL cap 1344 -256 R0
WINDOW 3 29 -18 Left 2
SYMATTR Value 100n
SYMATTR InstName C11
SYMBOL e 1184 -176 R180
WINDOW 0 52 46 Left 2
WINDOW 3 61 74 Left 2
SYMATTR InstName E4
SYMATTR Value 1
SYMBOL res 2432 1328 M90
WINDOW 0 0 56 VBottom 2
WINDOW 3 32 56 VTop 2
SYMATTR InstName R2
SYMATTR Value 1k
SYMBOL cap 2448 1392 M0
WINDOW 0 44 17 Left 2
WINDOW 3 42 44 Left 2
SYMATTR InstName C1
SYMATTR Value 150p
SYMBOL bv 2560 1360 M0
WINDOW 0 -87 43 Left 2
WINDOW 3 -175 73 Left 2
SYMATTR InstName B1
SYMATTR Value V=V(pa,N)
SYMBOL res 2432 1600 M90
WINDOW 0 0 56 VBottom 2
WINDOW 3 32 56 VTop 2
SYMATTR InstName R4
SYMATTR Value 1k
SYMBOL cap 2448 1664 M0
WINDOW 0 37 16 Left 2
WINDOW 3 38 44 Left 2
SYMATTR InstName C2
SYMATTR Value 150p
SYMBOL bv 2560 1632 M0
WINDOW 0 -87 43 Left 2
WINDOW 3 -177 69 Left 2
SYMATTR InstName B2
SYMATTR Value V=V(pb,N)
SYMBOL res 2432 1856 M90
WINDOW 0 0 56 VBottom 2
WINDOW 3 32 56 VTop 2
SYMATTR InstName R5
SYMATTR Value 1k
SYMBOL cap 2448 1920 M0
WINDOW 0 51 17 Left 2
WINDOW 3 49 43 Left 2
SYMATTR InstName C3
SYMATTR Value 150p
SYMBOL bv 2560 1888 M0
WINDOW 0 -87 43 Left 2
WINDOW 3 -171 68 Left 2
SYMATTR InstName B3
SYMATTR Value V=V(pc,N)
SYMBOL res 2880 1328 M90
WINDOW 0 0 56 VBottom 2
WINDOW 3 32 56 VTop 2
SYMATTR InstName R18
SYMATTR Value 1k
SYMBOL cap 2896 1392 M0
WINDOW 0 44 17 Left 2
WINDOW 3 42 44 Left 2
SYMATTR InstName C12
SYMATTR Value 150p
SYMBOL bv 3008 1360 M0
WINDOW 0 -87 43 Left 2
WINDOW 3 -175 73 Left 2
SYMATTR InstName B6
SYMATTR Value V=V(pa,pb)
SYMBOL res 2880 1600 M90
WINDOW 0 0 56 VBottom 2
WINDOW 3 32 56 VTop 2
SYMATTR InstName R22
SYMATTR Value 1k
SYMBOL cap 2896 1664 M0
WINDOW 0 37 16 Left 2
WINDOW 3 38 44 Left 2
SYMATTR InstName C13
SYMATTR Value 150p
SYMBOL bv 3008 1632 M0
WINDOW 0 -87 43 Left 2
WINDOW 3 -177 69 Left 2
SYMATTR InstName B7
SYMATTR Value V=V(pb,pc)
SYMBOL res 2880 1856 M90
WINDOW 0 0 56 VBottom 2
WINDOW 3 32 56 VTop 2
SYMATTR InstName R23
SYMATTR Value 1k
SYMBOL cap 2896 1920 M0
WINDOW 0 51 17 Left 2
WINDOW 3 49 43 Left 2
SYMATTR InstName C14
SYMATTR Value 150p
SYMBOL bv 3008 1888 M0
WINDOW 0 -87 43 Left 2
WINDOW 3 -171 68 Left 2
SYMATTR InstName B8
SYMATTR Value V=V(pc,pa)
SYMBOL res 3360 1328 M90
WINDOW 0 0 56 VBottom 2
WINDOW 3 32 56 VTop 2
SYMATTR InstName R24
SYMATTR Value 1k
SYMBOL cap 3376 1392 M0
WINDOW 0 44 17 Left 2
WINDOW 3 42 44 Left 2
SYMATTR InstName C15
SYMATTR Value 150p
SYMBOL bv 3488 1360 M0
WINDOW 0 -87 43 Left 2
WINDOW 3 -214 75 Left 2
SYMATTR InstName B9
SYMATTR Value V=V(pa,vo_2)
SYMBOL res 3360 1600 M90
WINDOW 0 0 56 VBottom 2
WINDOW 3 32 56 VTop 2
SYMATTR InstName R25
SYMATTR Value 1k
SYMBOL cap 3376 1664 M0
WINDOW 0 37 16 Left 2
WINDOW 3 38 44 Left 2
SYMATTR InstName C16
SYMATTR Value 150p
SYMBOL bv 3488 1632 M0
WINDOW 0 -87 43 Left 2
WINDOW 3 -216 72 Left 2
SYMATTR InstName B10
SYMATTR Value V=V(pb,vo_2)
SYMBOL res 3360 1856 M90
WINDOW 0 0 56 VBottom 2
WINDOW 3 32 56 VTop 2
SYMATTR InstName R26
SYMATTR Value 1k
SYMBOL cap 3376 1920 M0
WINDOW 0 51 17 Left 2
WINDOW 3 49 43 Left 2
SYMATTR InstName C17
SYMATTR Value 150p
SYMBOL bv 3488 1888 M0
WINDOW 0 -87 43 Left 2
WINDOW 3 -214 68 Left 2
SYMATTR InstName B11
SYMATTR Value V=V(pc,vo_2)
TEXT 976 -48 Left 2 !.tran 0 300m 150m uic
TEXT 2952 -456 Left 2 !* Components for the d loop *\n.param Gfcd=40 ; magnitude at crossover *\n.param PSd=-110 ; phase lag at crossover *\n*\n* Enter Design Goals Information Here *\n*\n.param fcd=2k ; targeted crossover *\n.param PMd=60 ; choose phase margin at crossover *\n*\n* Enter the Values for Vout and Bridge Bias Current *\n*\n.param Rdd=100k\n*\n* Do not edit the below lines *\n.param boostd={PMd-PSd-90}\n.param Gd={10**(-Gfcd/20)}\n.param kd={tan((boostd/2+45)*pi/180)}\n.param fpd={fcd*kd}\n.param fzd={fcd/kd}\n.param C2d={1/(2*pi*fcd*Gd*kd*Rdd)}\n.param C1d={C2d*(kd**2-1)}\n.param R2d={kd/(C1d*2*pi*fcd)}\n*
TEXT 2952 -1064 Left 2 !* Components for the q loop *\n.param Gfcq=40 ; magnitude at crossover *\n.param PSq=-110 ; phase lag at crossover *\n*\n* Enter Design Goals Information Here *\n*\n.param fcq=2k ; targeted crossover *\n.param PMq=60 ; choose phase margin at crossover *\n*\n.param Rdq=100k\n*\n* Do not edit the below lines *\n.param boostq={PMq-PSq-90}\n.param Gq={10**(-Gfcq/20)}\n.param kq={tan((boostq/2+45)*pi/180)}\n.param fpq={fcq*kq}\n.param fzq={fcq/kq}\n.param C2q={1/(2*pi*fcq*Gq*kq*Rdq)}\n.param C1q={C2d*(kq**2-1)}\n.param R2q={kq/(C1q*2*pi*fcq)}\n*
TEXT 3632 -1040 Left 2 !.four 50 10 -1 I(Via)\n.four 50 10 -1 I(Vib)\n.four 50 10 -1 I(Vic)
TEXT 984 0 Left 2 !.options abstol=1u vntol=1m reltol=0.01 gmin=1n\n+method=gear\n*\n.MODEL TOFSW SW(Ron=25m Roff=10Meg Vt=2 Vh=1)\n.model TOFD D(IS=23.367E-18 N=.9983 RS=77.399E-3 IKF=1.0000E3 CJO=453.20E-12 M=.44242\n+ VJ=1.3170 ISR=31.573E-9 NR=2.4162 TT=0 XTI=2 EG=3.26 FC=0.5)\n; STPSC10H12CWL\n*
TEXT 1800 -1048 Left 2 !*\n.PARAM Fline=50 ; network frequency\n.PARAM Tref={1/Fline}\n.PARAM Vgrms=110 ; per phase line-neutral voltage\n.PARAM Vdc=400 ; dc rail value\n*\n.PARAM Vgpeak={Vgrms*sqrt(2)}\n.PARAM Vamp={Vgpeak*2}\n*\n.PARAM PWinj=30k ; absorbed power in watts\n.PARAM PQinj=8k  ; wanted VARs\n.PARAM RL={(Vgrms**2/PWinj)*3} ; equivalent load resistance per phase\n.PARAM RLPFC={(Vdc/2)**2/(PWinj/2)} ; load resistance per half Vdc\n.PARAM Ri=-0.1 ; current sense value per phase\n.PARAM KVin=0.1 ; voltage sense per phase\n.PARAM Fsw=30k ; switching frequency\n.PARAM Tsw={1/Fsw}\n.PARAM DT={150n}\n*\n.PARAM w={2*pi*Fline}\n.PARAM L=650u\n.PARAM t1=5m\n.PARAM theta=t1*Fline*2*pi ; angle in radians\n.PARAM Va={Vgpeak*sin(theta)} ; phase a voltage at time t1\n.PARAM Vb={Vgpeak*sin(theta-2*pi/3)} ; phase b voltage at time t1\n.PARAM Vc={Vgpeak*sin(theta-4*pi/3)} ; ; phase c voltage at time t1\n.PARAM ia={Va/RL} ; current at time t1 in phase a\n.PARAM ib={Vb/RL} ; current at time t1 in phase b\n.PARAM ic={Vc/RL} ; current at time t1 in phase c\n*\n.PARAM vd={sqrt(2/3)*(sin(theta)*Va+sin(theta-2*pi/3)*Vb+sin(theta+2*pi/3)*Vc)}\n.PARAM vq={sqrt(2/3)*(cos(theta)*Va+cos(theta-2*pi/3)*Vb+cos(theta+2*pi/3)*Vc)}\n.PARAM id={sqrt(2/3)*(sin(theta)*ia+sin(theta-2*pi/3)*ib+sin(theta+2*pi/3)*ic)}\n.PARAM iq={sqrt(2/3)*(cos(theta)*ia+cos(theta-2*pi/3)*ib+cos(theta+2*pi/3)*ic)}\n*\n.PARAM IdSET={(PWinj-id*vq)*Ri/vd} ; calculated setpoint [V] for the d value\n.PARAM IqSET={(id*vq-PQinj)*Ri/vd} ; calculated current setpoint [V] for the q value\n*
TEXT 1048 552 Left 2 ;d-q currents setpoints in V

The netlist it stands for:
* 3-phase NPC inverter with switches - PFC open loop - SVM.asc
Va a N SINE(0 {Vgpeak} {FLINE})
Vb b N SINE(0 {Vgpeak} {FLINE} 0 0 -120)
Vc c N SINE(0 {Vgpeak} {FLINE} 0 0 120)
R1 N 0 1G
rla N010 N013 10m
rlb N011 N014 10m
rlc N012 N015 10m
H1 ia 0 VIa {Ri}
H2 ib 0 VIb {Ri}
H3 ic 0 VIc {Ri}
La pa N010 {L}
Lb pb N011 {L}
Lc pc N012 {L}
VIa a N013 0
VIb b N014 0
VIc c N015 0
SWa1 N001 Vout Ga1 0 TOFSW
E1 va 0 a N {kvin}
E2 vb 0 b N {kvin}
E3 vc 0 c N {kvin}
R7 N021 N026 {R2d}
C4 N026 N020 {C1d}
C6 N021 N020 {C2d}
R8 0 N029 1Meg
R9 N021 Id {Rdd}
R10 N042 N047 {R2q}
C5 N047 N040 {C1q}
C7 N042 N040 {C2q}
R11 N042 Iq {Rdq}
D1 N001 Vout TOFD
SWa2 pa N001 Ga2 0 TOFSW
D7 pa N001 TOFD
SWa3 N005 pa Ga3 0 TOFSW
D2 N005 pa TOFD
SWa4 0 N005 Ga4 0 TOFSW
D8 0 N005 TOFD
D9 Vo_2 N001 TOFD
D10 N005 Vo_2 TOFD
D3 N002 Vout TOFD
D4 pb N002 TOFD
D5 N006 pb TOFD
D6 0 N006 TOFD
D11 Vo_2 N002 TOFD
D12 N006 Vo_2 TOFD
D13 N003 Vout TOFD
D14 pc N003 TOFD
D15 N007 pc TOFD
D16 0 N007 TOFD
D17 Vo_2 N003 TOFD
D18 N007 Vo_2 TOFD
SWb1 N002 Vout Gb1 0 TOFSW
SWb2 pb N002 Gb2 0 TOFSW
SWb3 N006 pb Gb3 0 TOFSW
SWb4 0 N006 Gb4 0 TOFSW
SWc1 N003 Vout Gc1 0 TOFSW
SWc2 pc N003 Gc2 0 TOFSW
SWc3 N007 pc Gc3 0 TOFSW
SWc4 0 N007 Gc4 0 TOFSW
R13 vd_st N018 10k
R19 N018 N020 10k
R20 vq_st N041 10k
R21 N041 N040 10k
Vd_SET N017 0 {IdSET}
Vq_SET N016 0 {IqSET}
X§X2 N023 N032 theta 0 N030 N034 NC_01 inverse_dq_alpha_beta params: CLP=1500 CLN=-1500
X§X3 N030 N034 N028 N031 N033 N035 N036 N038 N027 N043 N044 N045 N046 N037 N022 N024 N025 alphabetatimings params: Tsw={Tsw} k1=1
X§X4 N028 N031 N033 N035 N036 N038 N043 N044 N045 N046 G1a G1b G1c G2a G2b G2c N022 N024 N025 timinggenerator params: Tsw={Tsw}
X§X1 ia ib ic theta N029 Id Iq dq0_sub  ; pins Ia Ib Ic theta I0 Id Iq
X§X22 N021 N017 N020 opampTOF params: VHIGH=5 VLOW=-5  ; pins - + OUT
X§X10 N018 0 vd_st opampTOF params: VHIGH=5 VLOW=-5  ; pins - + OUT
X§X19 N041 0 vq_st opampTOF params: VHIGH=5 VLOW=-5  ; pins - + OUT
X§X20 N042 N016 N040 opampTOF params: VHIGH=5 VLOW=-5  ; pins - + OUT
X§X9 Q13a Ga1 Ga3 dt_driver params: DT={DT}
X§X14 Q24a Ga2 Ga4 dt_driver params: DT={DT}
X§X15 Q13b Gb1 Gb3 dt_driver params: DT={DT}
X§X16 Q24b Gb2 Gb4 dt_driver params: DT={DT}
X§X17 Q24c Gc2 Gc4 dt_driver params: DT={DT}
X§X18 Q13c Gc1 Gc3 dt_driver params: DT={DT}
V4 N054 0 PULSE(0.5 0 0 {Tsw/2} {Tsw/2} 1p {Tsw})
E10 N055 0 G1a 0 {Fline}
E11 N061 0 G2a 0 {Fline}
E12 N056 0 G1b 0 {Fline}
E13 N062 0 G2b 0 {Fline}
E14 N057 0 G1c 0 {Fline}
E15 N063 0 G2c 0 {Fline}
X§X13 N054 N056 Q13b comptof params: VHIGH=5 VLOW=100m VHYS=10m
X§X23 N054 N055 Q13a comptof params: VHIGH=5 VLOW=100m VHYS=10m
X§X24 N054 N061 Q24a comptof params: VHIGH=5 VLOW=100m VHYS=10m
X§X25 N054 N062 Q24b comptof params: VHIGH=5 VLOW=100m VHYS=10m
X§X26 N054 N057 Q13c comptof params: VHIGH=5 VLOW=100m VHYS=10m
X§X27 N054 N063 Q24c comptof params: VHIGH=5 VLOW=100m VHYS=10m
B4 N023 0 V=V(vd_st)/({KVin}*{Ri})+{w}*{L}*V(Iq)/{Ri}+V(Vd)/{KVin}
B5 N032 0 V=V(vq_st)/({KVin}*{Ri})-{w}*{L}*V(Id)/{Ri}+V(Vq)/{KVin}
R6 theta 0 1Meg
X§X5 va vb vc theta theta_sub  ; pins Va Vb Vc theta
X§X6 va vb vc theta N039 Vd Vq dq0_sub  ; pins Ia Ib Ic theta I0 Id Iq
C8 N004 Vo_2 2m IC={Vdc/2}
C9 N008 0 2m IC={Vdc/2}
R3 Vout Vo_2 {RLPFC}
R12 Vo_2 0 {RLPFC}
R14 Vout N004 100m
R15 Vo_2 N008 100m
R16 Vlower Vo_2 1k
C10 0 Vlower 100n
R17 Vupper N009 1k
C11 0 Vupper 100n
E4 N009 0 Vout Vo_2 1
R2 phase_a N048 1k
C1 phase_a 0 150p
B1 N048 0 V=V(pa,N)
R4 phase_b N051 1k
C2 phase_b 0 150p
B2 N051 0 V=V(pb,N)
R5 phase_c N058 1k
C3 phase_c 0 150p
B3 N058 0 V=V(pc,N)
R18 phase_ab N049 1k
C12 phase_ab 0 150p
B6 N049 0 V=V(pa,pb)
R22 phase_bc N052 1k
C13 phase_bc 0 150p
B7 N052 0 V=V(pb,pc)
R23 phase_ca N059 1k
C14 phase_ca 0 150p
B8 N059 0 V=V(pc,pa)
R24 PhaseA N050 1k
C15 PhaseA 0 150p
B9 N050 0 V=V(pa,vo_2)
R25 PhaseB N053 1k
C16 PhaseB 0 150p
B10 N053 0 V=V(pb,vo_2)
R26 PhaseC N060 1k
C17 PhaseC 0 150p
B11 N060 0 V=V(pc,vo_2)

* block symbol definitions
.subckt inverse_dq_alpha_beta d q theta zero Ialpha Ibeta Izero
R1 d 0 1Meg
R2 q 0 1Meg
R3 zero 0 1Meg
B1 Ialpha1 0 V=cos(V(theta))*V(d)-sin(V(theta))*V(q)
B2 Ibeta1 0 V=sin(V(theta))*V(d)+cos(V(theta))*V(q)
R4 theta 0 1Meg
B3 I00 0 V=V(zero)
B4 N001 0 V=IF(V(Ialpha1)>{CLP},{CLP},IF(V(Ialpha1)<{CLN},{CLN},V(Ialpha1)))
B5 N002 0 V=IF(V(Ibeta1)>{CLP},{CLP},IF(V(Ibeta1)<{CLN},{CLN},V(Ibeta1)))
B6 N003 0 V=IF(V(I00)>{CLP},{CLP},IF(V(I00)<{CLN},{CLN},V(I00)))
R5 Ialpha N001 1k
R6 Izero N003 1k
R7 Ibeta N002 1k
C1 Ialpha 0 10p
C2 Izero 0 10p
C3 Ibeta 0 10p
.ends inverse_dq_alpha_beta

.subckt alphabetatimings Alpha Beta R1 R2 R3 R4 R5 R6 RegionV RS1 RS2 RS3 RS4 SectorV ta tb tc
B1 Ref 0 V=(sqrt(V(alpha)**2+V(beta)**2))
B2 Theta 0 V=(atan2(V(beta),V(alpha)))
B3 AngleD 0 V=(atan2(V(beta),V(alpha)))*180/pi
R1 Alpha 0 1Meg
R2 Beta 0 1Meg
B4 RS1 0 V=If( (V(m1)<0.5 ) & (V(m2)<0.5) & (V(sum_m12)<0.5), 5,0 )
B5 RS2 0 V=If( (V(m1)<0.5 ) & (V(m2)<0.5) & (V(sum_m12)>0.5), 5,0 )
B6 RS3 0 V=If( V(m1)>0.5, 5,0 )
B7 RS4 0 V=If( V(m2)>0.5, 5,0 )
B8 m1 0 V=V(mn)*(cos(V(thetaS))-sin(V(thetaS))/sqrt(3))
B9 mn 0 V=V(ref)*1.5/{Vdc}
B10 m2 0 V=(2*V(mn)/sqrt(3))*sin(V(thetaS))
B11 sum_m12 0 V=V(m1)+V(m2)
B12 R1 0 V=IF ( (V(AngleD)>0) & (V(AngleD)<60), 5, 0 )
B13 R3 0 V=IF ( (V(AngleD)>120) & (V(AngleD)<180), 5, 0 )
B14 R5 0 V=IF ( (V(AngleD)>-120) & (V(AngleD)<-60), 5, 0 )
B15 R2 0 V=IF ( (V(AngleD)>60) & (V(AngleD)<120), 5, 0 )
B16 R4 0 V=IF ( (V(AngleD)>-180) & (V(AngleD)<-120), 5, 0 )
B17 R6 0 V=IF ( (V(AngleD)>-60) & (V(AngleD)<0), 5, 0 )
B18 ThetaS 0 V=If ( V(R2)>2.5,V(theta)-pi/3, if (V(R3)>2.5,V(theta)-2*pi/3, If ( V(R4)>2.5,V(theta)+pi, If ( V(R5)>2.5,V(theta)+2*pi/3 , if ( V(R6)>2.55,V(theta)+pi/3, V(theta) )))))
B19 ThetaSD 0 V=V(ThetaS)*180/pi
B20 ta1 0 V=4*V(mn)*{Tref}*sin(pi/3-V(ThetaS))/sqrt(3)
B21 ta3 0 V=2*{Tref}-4*V(mn)*{Tref}*sin(V(ThetaS)+pi/3)/sqrt(3)
B22 ta2 0 V={Tref}-4*V(mn)*{Tref}*sin(V(ThetaS))/sqrt(3)
B23 ta4 0 V=4*V(mn)*{Tref}*sin(V(ThetaS))/sqrt(3)-{Tref}
B24 tb1 0 V={Tref}-4*V(mn)*{Tref}*sin(V(ThetaS)+pi/3)/sqrt(3)
B25 tb3 0 V=4*V(mn)*{Tref}*sin(V(ThetaS))/sqrt(3)
B26 tb2 0 V=4*V(mn)*{Tref}*sin(V(ThetaS)+pi/3)/sqrt(3)-{Tref}
B27 tb4 0 V=4*V(mn)*{Tref}*sin(pi/3-V(ThetaS))/sqrt(3)
B28 tc1 0 V=4*V(mn)*{Tref}*sin(V(ThetaS))/sqrt(3)
B29 tc3 0 V=4*V(mn)*{Tref}*sin(pi/3-V(ThetaS))/sqrt(3)-{Tref}
B30 tc2 0 V={Tref}-4*V(mn)*{Tref}*sin(pi/3-V(ThetaS))/sqrt(3)
B31 tc4 0 V=2*{Tref}-4*V(mn)*{Tref}*sin(V(ThetaS)+pi/3)/sqrt(3)
B32 TswTEST 0 V=V(ta)+V(tb)+V(tc)
B33 SectorV 0 V=IF (V(R1)>2.5,1, IF ( V(R2)>2.5,2, IF (V(R3)>2.5,3, IF (V(R4)>2.5, 4, IF (V(R5)>2.5,5, IF (V(R6)>2.5,6,0))))))
B34 RegionV 0 V=IF (V(RS1)>2.5,1, IF ( V(RS2)>2.5,2, IF (V(RS3)>2.5,3, IF (V(RS4)>2.5,4,0))))
B38 ta 0 V=IF (V(Nta)>{Tref},{Tref}, IF (V(Nta)<0,0,V(Nta) ))
B39 tb 0 V=IF (V(Ntb)>{Tref},{Tref}, IF (V(Ntb)<0,0,V(Ntb) ))
B40 tc 0 V=IF (V(Ntc)>{Tref},{Tref}, IF (V(Ntc)<0,0,V(Ntc) ))
B41 NTa 0 V=IF (V(RS1)>2.5,V(Ta1), IF ( V(RS2)>2.5,V(Ta2), IF (V(RS3)>2.5,V(Ta3), IF (V(RS4)>2.5, V(Ta4), 0 ))))
B42 NTb 0 V=IF (V(RS1)>2.5,V(Tb1), IF ( V(RS2)>2.5,V(Tb2), IF (V(RS3)>2.5,V(Tb3), IF (V(RS4)>2.5, V(Tb4), 0 ))))
B43 NTc 0 V=IF (V(RS1)>2.5,V(Tc1), IF ( V(RS2)>2.5,V(Tc2), IF (V(RS3)>2.5,V(Tc3), IF (V(RS4)>2.5, V(Tc4), 0 ))))
B35 m2a 0 V=(2*V(mn)*sin(V(theta)-(V(sectorV)-1)*(pi/3)))/sqrt(3)
B36 m1a 0 V=(2*V(mn)*sin(V(sectorV)*pi/3-V(theta)))/sqrt(3)
* Angle in radians
* Magnitude of the reference vector to be synthesized
* Angle in degrees
* Sub-region 1-4 determination
* m1 calculation
* m2 calculation
* Region 1-6 determination
* This is the modulation index
* Brings any angle from the reference vector to an
* angle located in sector 1 - from 0 to 60° or 0 to pi/3
* ThetaS in degrees
* Timings for ta, tb and tc selected based on the sub-region 1 to 4.
* Plots the sector depending on the reference angle
* Plots the sub-triangle and region 1-4 depending
* on the vectors to be synthesized (LV, SV, MV, Zero).
.MODEL TOFGATE SW(Ron=100m Roff=100Meg Vt=2 Vh=1)
* alternate implementation
* alternate implementation
.ends alphabetatimings

.subckt timinggenerator R1 R2 R3 R4 R5 R6 RS1 RS2 RS3 RS4 G1a G1b G1c G2a G2b G2c ta tb tc
B1 s1a 0 V=If (V(RS1)>2.5, V(ta)/4+V(tc)/4+V(tb)/4, If (V(RS2)>2.5, V(ta)/4+V(tc)/4+V(tb)/2, If (V(RS3)>2.5, V(ta)/4+V(tc)/2+V(tb)/2, If (V(RS4)>2.5, V(ta)/2+V(tc)/4+V(tb)/2,0 ))))
B2 s2a 0 V=If (V(RS1)>2.5, V(ta)/2+V(tc)/2+V(tb)/4+V(tb)/2, If (V(RS2)>2.5, V(ta)/2+V(tb)/2+V(tc)/2, If (V(RS3)>2.5, V(ta)/2+V(tc)/2+V(tb)/2, If (V(RS4)>2.5, V(ta)/2+V(tc)/2+V(tb)/2,0 ))))
B3 s1b 0 V=If (V(RS1)>2.5, V(tc)/4+V(tb)/4, If (V(RS2)>2.5, V(tc)/4, If (V(RS3)>2.5, 0, If (V(RS4)>2.5, V(ta)/2+V(tc)/4,0 ))))
B4 s2b 0 V=If (V(RS1)>2.5, V(ta)/4+V(tc)/2+V(tb)/4+V(tb)/2, If (V(RS2)>2.5, V(ta)/4+V(tb)/2+V(tc)/2, If (V(RS3)>2.5, V(ta)/4+V(tb)/2, If (V(RS4)>2.5, V(ta)/2+V(tc)/2+V(tb)/2,0 ))))
B5 s1c 0 V=If (V(RS1)>2.5, V(tb)/4, If (V(RS2)>2.5, 0, If (V(RS3)>2.5, 0, If (V(RS4)>2.5, 0,0 ))))
B6 s2c 0 V=If (V(RS1)>2.5, V(ta)/4+V(tc)/4+V(tb)/4+V(tb)/2, If (V(RS2)>2.5, V(ta)/4+V(tc)/4, If (V(RS3)>2.5, V(ta)/4, If (V(RS4)>2.5, V(tc)/4,0 ))))
B7 G1a 0 V=If (V(R1)>2.5, V(S1a), IF ( V(R2)>2.5, {Tref}/2-V(s2b), IF (V(R3)>2.5, V(s1c), IF (V(R4)>2.5, {Tref}/2-V(s2a), IF (V(R5)>2.5, V(S1b), IF (V(R6)>2.5, {Tref}/2-V(s2c),0 ))))))
B8 G2a 0 V=If (V(R1)>2.5, V(S2a), IF ( V(R2)>2.5, {Tref}/2-V(s1b), IF (V(R3)>2.5, V(s2c), IF (V(R4)>2.5, {Tref}/2-V(s1a), IF (V(R5)>2.5, V(S2b), IF (V(R6)>2.5, {Tref}/2-V(s1c),0 ))))))
B9 G1b 0 V=If (V(R1)>2.5, V(S1b), IF ( V(R2)>2.5, {Tref}/2-V(s2c), IF (V(R3)>2.5, V(s1a), IF (V(R4)>2.5, {Tref}/2-V(s2b), IF (V(R5)>2.5, V(S1c), IF (V(R6)>2.5, {Tref}/2-V(s2a),0 ))))))
B10 G2b 0 V=If (V(R1)>2.5, V(S2b), IF ( V(R2)>2.5, {Tref}/2-V(s1c), IF (V(R3)>2.5, V(s2a), IF (V(R4)>2.5, {Tref}/2-V(s1b), IF (V(R5)>2.5, V(S2c), IF (V(R6)>2.5, {Tref}/2-V(s1a),0 ))))))
B11 G1c 0 V=If (V(R1)>2.5, V(S1c), IF ( V(R2)>2.5, {Tref}/2-V(s2a), IF (V(R3)>2.5, V(s1b), IF (V(R4)>2.5, {Tref}/2-V(s2c), IF (V(R5)>2.5, V(S1a), IF (V(R6)>2.5, {Tref}/2-V(s2b),0 ))))))
B12 G2c 0 V=If (V(R1)>2.5, V(S2c), IF ( V(R2)>2.5, {Tref}/2-V(s1a), IF (V(R3)>2.5, V(s2b), IF (V(R4)>2.5, {Tref}/2-V(s1c), IF (V(R5)>2.5, V(S2a), IF (V(R6)>2.5, {Tref}/2-V(s1b),0 ))))))
R1 RS1 0 1Meg
R2 RS2 0 1Meg
R3 RS3 0 1Meg
R4 RS4 0 1Meg
R5 R1 0 1Meg
R6 R2 0 1Meg
R7 R3 0 1Meg
R8 R4 0 1Meg
R9 R5 0 1Meg
R10 R6 0 1Meg
R11 ta 0 1Meg
R12 tb 0 1Meg
R13 tc 0 1Meg
* Timing patterns to form the various + - 0 states (P N 0)
* for sub-regions 1 to 4.
.ends timinggenerator

.subckt dt_driver IN OutN OutP
A1 IN 0 0 0 0 N004 N001 0 BUF Vhigh=5 Vlow=0 Ref=1.0
R1 N003 N001 1k
C1 N003 0 {CDT}
R2 N006 N004 1k
C2 N006 0 {CDT}
A2 0 N001 0 N003 0 0 N002 0 AND Vhigh=5 Vlow=0 Ref=2.5
A3 0 N004 0 N006 0 0 N005 0 AND Vhigh=5 Vlow=0 Ref=2.5
D1 N003 N001 1N4148
D2 N006 N004 D
R3 OutN N002 10
R4 OutP N005 10
C3 OutN 0 10p
C4 OutP 0 10p
.param CDT={DT/(0.691*1k)}
.ends dt_driver

.subckt comptof INV NINV OUT
B1 HYS NINV V=IF(V(out) > ({VHIGH}+{VLOW})/2,{VHYS},0)
B2 N001 0 V=IF(V(HYS,INV)>0,{VHIGH},{VLOW})
R1 N001 OUT 10
C1 OUT 0 10p
R2 INV 0 1Meg
.ends comptof

.model D D
.lib standard.dio
.tran 0 300m 150m uic
* Components for the d loop *
.param Gfcd=40 ; magnitude at crossover *
.param PSd=-110 ; phase lag at crossover *
*
* Enter Design Goals Information Here *
*
.param fcd=2k ; targeted crossover *
.param PMd=60 ; choose phase margin at crossover *
*
* Enter the Values for Vout and Bridge Bias Current *
*
.param Rdd=100k
*
* Do not edit the below lines *
.param boostd={PMd-PSd-90}
.param Gd={10**(-Gfcd/20)}
.param kd={tan((boostd/2+45)*pi/180)}
.param fpd={fcd*kd}
.param fzd={fcd/kd}
.param C2d={1/(2*pi*fcd*Gd*kd*Rdd)}
.param C1d={C2d*(kd**2-1)}
.param R2d={kd/(C1d*2*pi*fcd)}
*
* Components for the q loop *
.param Gfcq=40 ; magnitude at crossover *
.param PSq=-110 ; phase lag at crossover *
*
* Enter Design Goals Information Here *
*
.param fcq=2k ; targeted crossover *
.param PMq=60 ; choose phase margin at crossover *
*
.param Rdq=100k
*
* Do not edit the below lines *
.param boostq={PMq-PSq-90}
.param Gq={10**(-Gfcq/20)}
.param kq={tan((boostq/2+45)*pi/180)}
.param fpq={fcq*kq}
.param fzq={fcq/kq}
.param C2q={1/(2*pi*fcq*Gq*kq*Rdq)}
.param C1q={C2d*(kq**2-1)}
.param R2q={kq/(C1q*2*pi*fcq)}
*
.four 50 10 -1 I(Via)
.four 50 10 -1 I(Vib)
.four 50 10 -1 I(Vic)
.options abstol=1u vntol=1m reltol=0.01 gmin=1n
+method=gear
*
.MODEL TOFSW SW(Ron=25m Roff=10Meg Vt=2 Vh=1)
.model TOFD D(IS=23.367E-18 N=.9983 RS=77.399E-3 IKF=1.0000E3 CJO=453.20E-12 M=.44242
+ VJ=1.3170 ISR=31.573E-9 NR=2.4162 TT=0 XTI=2 EG=3.26 FC=0.5)
; STPSC10H12CWL
*
*
.PARAM Fline=50 ; network frequency
.PARAM Tref={1/Fline}
.PARAM Vgrms=110 ; per phase line-neutral voltage
.PARAM Vdc=400 ; dc rail value
*
.PARAM Vgpeak={Vgrms*sqrt(2)}
.PARAM Vamp={Vgpeak*2}
*
.PARAM PWinj=30k ; absorbed power in watts
.PARAM PQinj=8k  ; wanted VARs
.PARAM RL={(Vgrms**2/PWinj)*3} ; equivalent load resistance per phase
.PARAM RLPFC={(Vdc/2)**2/(PWinj/2)} ; load resistance per half Vdc
.PARAM Ri=-0.1 ; current sense value per phase
.PARAM KVin=0.1 ; voltage sense per phase
.PARAM Fsw=30k ; switching frequency
.PARAM Tsw={1/Fsw}
.PARAM DT={150n}
*
.PARAM w={2*pi*Fline}
.PARAM L=650u
.PARAM t1=5m
.PARAM theta=t1*Fline*2*pi ; angle in radians
.PARAM Va={Vgpeak*sin(theta)} ; phase a voltage at time t1
.PARAM Vb={Vgpeak*sin(theta-2*pi/3)} ; phase b voltage at time t1
.PARAM Vc={Vgpeak*sin(theta-4*pi/3)} ; ; phase c voltage at time t1
.PARAM ia={Va/RL} ; current at time t1 in phase a
.PARAM ib={Vb/RL} ; current at time t1 in phase b
.PARAM ic={Vc/RL} ; current at time t1 in phase c
*
.PARAM vd={sqrt(2/3)*(sin(theta)*Va+sin(theta-2*pi/3)*Vb+sin(theta+2*pi/3)*Vc)}
.PARAM vq={sqrt(2/3)*(cos(theta)*Va+cos(theta-2*pi/3)*Vb+cos(theta+2*pi/3)*Vc)}
.PARAM id={sqrt(2/3)*(sin(theta)*ia+sin(theta-2*pi/3)*ib+sin(theta+2*pi/3)*ic)}
.PARAM iq={sqrt(2/3)*(cos(theta)*ia+cos(theta-2*pi/3)*ib+cos(theta+2*pi/3)*ic)}
*
.PARAM IdSET={(PWinj-id*vq)*Ri/vd} ; calculated setpoint [V] for the d value
.PARAM IqSET={(id*vq-PQinj)*Ri/vd} ; calculated current setpoint [V] for the q value
*
* d-q currents setpoints in V
.backanno
.end